# Altium project as14120_x31.PrjPCB (part 2 of 3)

## Sheet as14120_x31_fpga_ddr.SchDoc
size A2; PageSetup: Record=PageOptions|CenterHorizontal=True|CenterVertical=True|PrintScale=1.02|XCorrection=1.00|YCorrection=1.00|PrintKind=1|BorderSize=5000000|LeftOffset=0|BottomOffset=0|Orientation=2|PaperLength=4200|PaperWidth=2970|Scale=100|PaperSource=7|PrintQuality=-4|MediaType=1|DitherType=10|PaperKind=A3 (бумага продольной резки) (297 x 420 мм)|PrintScaleMode=1
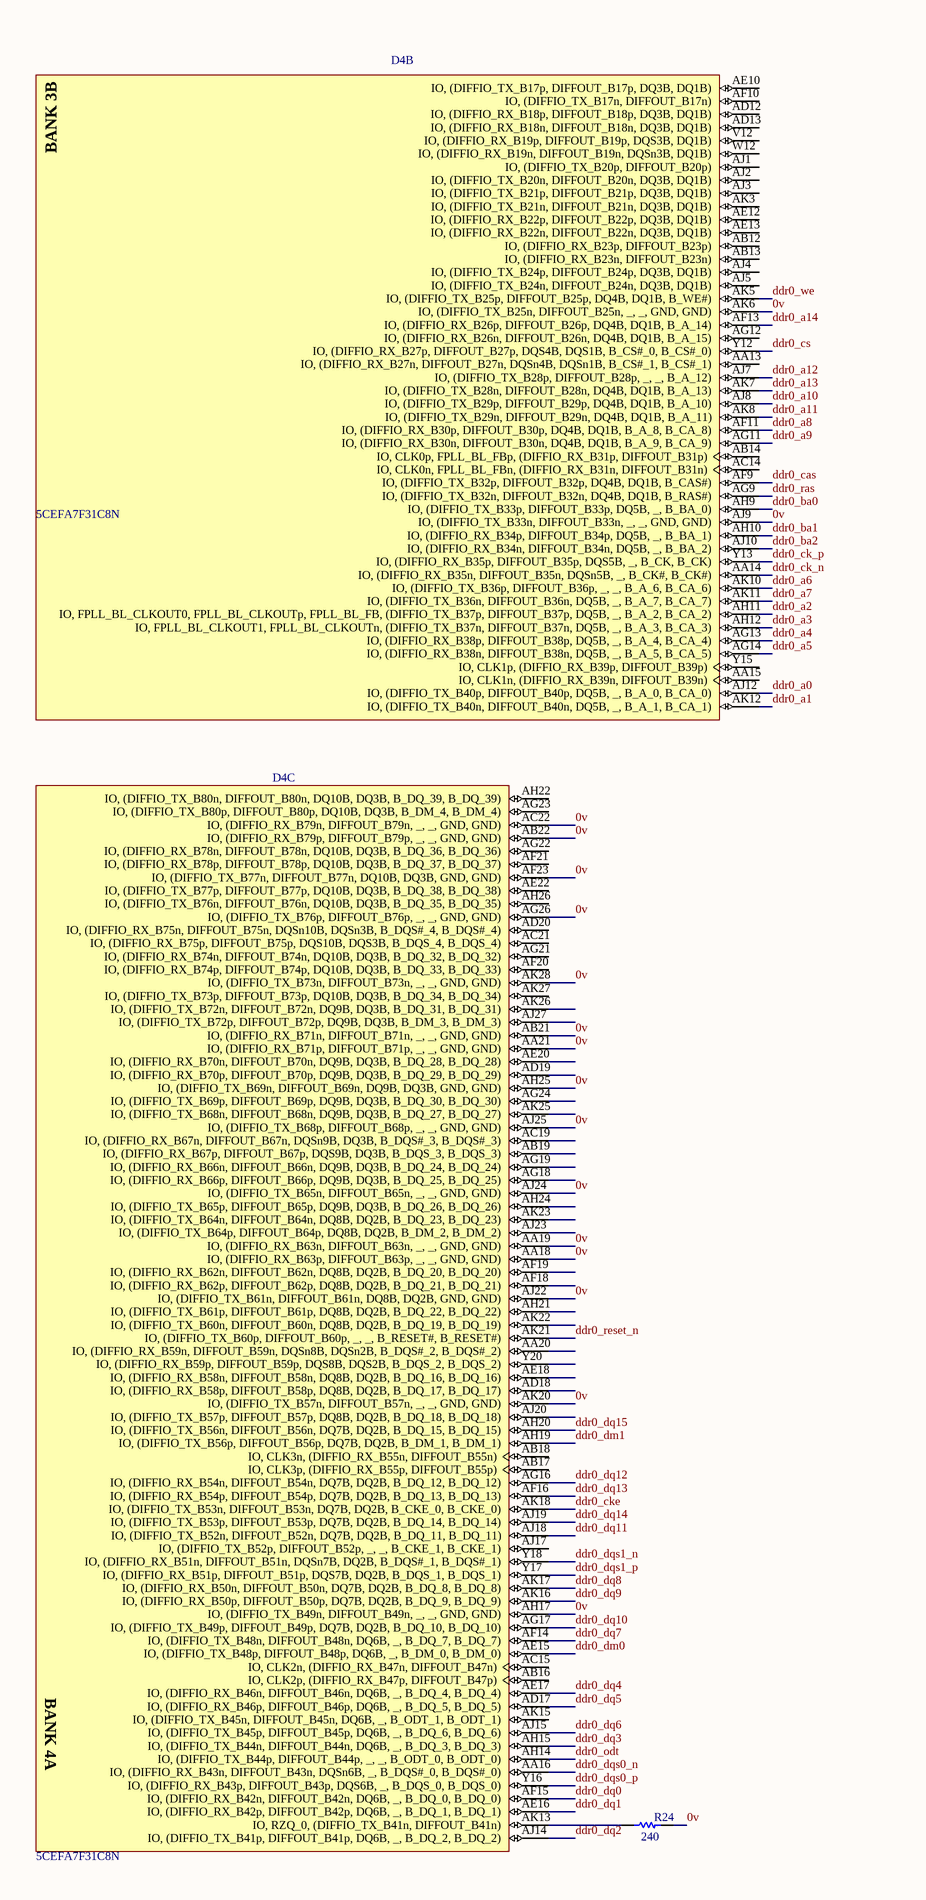
[diagram p4: as14120_x31_fpga_ddr.SchDoc, left]
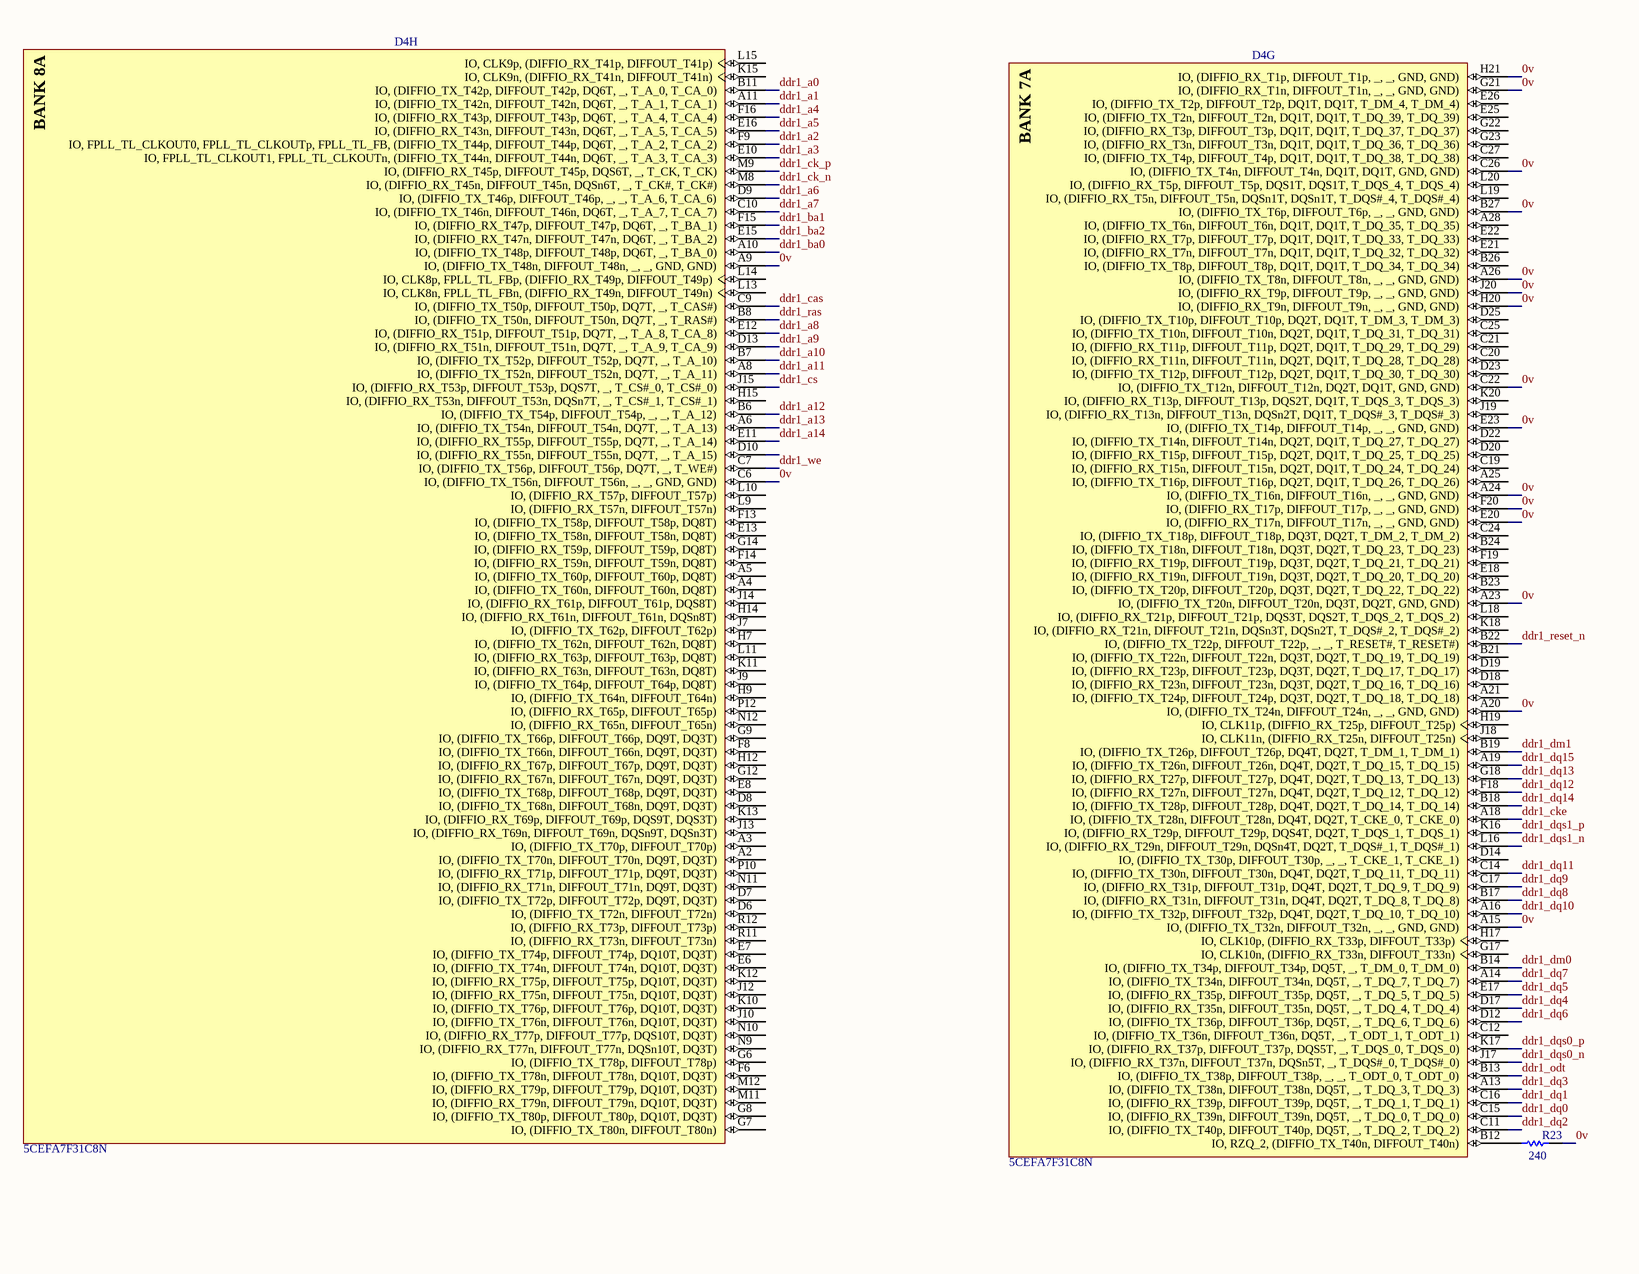
[diagram p5: as14120_x31_fpga_ddr.SchDoc, right]

### Parts
D4  5CEFA7F31C8N  [ALTR-896-FBGA-2000A]  (parts B,C,G,H of 13)
R23  value 240  [RESC0805(2012)_L]  (hidden comment: 1K 1% 0805(2012))
R24  value 240  [RESC0805(2012)_L]  (hidden comment: 1K 1% 0805(2012))

### Nets
0v: D4.A9(IO,_(DIFFIO_TX_T48n,_DIFFOUT_T48n,__,__,_GND,_GND)) D4.A15(IO,_(DIFFIO_TX_T32n,_DIFFOUT_T32n,__,__,_GND,_GND)) D4.A20(IO,_(DIFFIO_TX_T24n,_DIFFOUT_T24n,__,__,_GND,_GND)) D4.A23(IO,_(DIFFIO_TX_T20n,_DIFFOUT_T20n,_DQ3T,_DQ2T,_GND,_GND)) D4.A24(IO,_(DIFFIO_TX_T16n,_DIFFOUT_T16n,__,__,_GND,_GND)) D4.A26(IO,_(DIFFIO_TX_T8n,_DIFFOUT_T8n,__,__,_GND,_GND)) D4.AA18(IO,_(DIFFIO_RX_B63p,_DIFFOUT_B63p,__,__,_GND,_GND)) D4.AA19(IO,_(DIFFIO_RX_B63n,_DIFFOUT_B63n,__,__,_GND,_GND)) D4.AA21(IO,_(DIFFIO_RX_B71p,_DIFFOUT_B71p,__,__,_GND,_GND)) D4.AB21(IO,_(DIFFIO_RX_B71n,_DIFFOUT_B71n,__,__,_GND,_GND)) D4.AB22(IO,_(DIFFIO_RX_B79p,_DIFFOUT_B79p,__,__,_GND,_GND)) D4.AC22(IO,_(DIFFIO_RX_B79n,_DIFFOUT_B79n,__,__,_GND,_GND)) D4.AF23(IO,_(DIFFIO_TX_B77n,_DIFFOUT_B77n,_DQ10B,_DQ3B,_GND,_GND)) D4.AG26(IO,_(DIFFIO_TX_B76p,_DIFFOUT_B76p,__,__,_GND,_GND)) D4.AH17(IO,_(DIFFIO_TX_B49n,_DIFFOUT_B49n,__,__,_GND,_GND)) D4.AH25(IO,_(DIFFIO_TX_B69n,_DIFFOUT_B69n,_DQ9B,_DQ3B,_GND,_GND)) D4.AJ9(IO,_(DIFFIO_TX_B33n,_DIFFOUT_B33n,__,__,_GND,_GND)) D4.AJ22(IO,_(DIFFIO_TX_B61n,_DIFFOUT_B61n,_DQ8B,_DQ2B,_GND,_GND)) D4.AJ24(IO,_(DIFFIO_TX_B65n,_DIFFOUT_B65n,__,__,_GND,_GND)) D4.AJ25(IO,_(DIFFIO_TX_B68p,_DIFFOUT_B68p,__,__,_GND,_GND)) D4.AK6(IO,_(DIFFIO_TX_B25n,_DIFFOUT_B25n,__,__,_GND,_GND)) D4.AK20(IO,_(DIFFIO_TX_B57n,_DIFFOUT_B57n,__,__,_GND,_GND)) D4.AK28(IO,_(DIFFIO_TX_B73n,_DIFFOUT_B73n,__,__,_GND,_GND)) D4.B27(IO,_(DIFFIO_TX_T6p,_DIFFOUT_T6p,__,__,_GND,_GND)) D4.C6(IO,_(DIFFIO_TX_T56n,_DIFFOUT_T56n,__,__,_GND,_GND)) D4.C22(IO,_(DIFFIO_TX_T12n,_DIFFOUT_T12n,_DQ2T,_DQ1T,_GND,_GND)) D4.C26(IO,_(DIFFIO_TX_T4n,_DIFFOUT_T4n,_DQ1T,_DQ1T,_GND,_GND)) D4.E20(IO,_(DIFFIO_RX_T17n,_DIFFOUT_T17n,__,__,_GND,_GND)) D4.E23(IO,_(DIFFIO_TX_T14p,_DIFFOUT_T14p,__,__,_GND,_GND)) D4.F20(IO,_(DIFFIO_RX_T17p,_DIFFOUT_T17p,__,__,_GND,_GND)) D4.G21(IO,_(DIFFIO_RX_T1n,_DIFFOUT_T1n,__,__,_GND,_GND)) D4.H20(IO,_(DIFFIO_RX_T9n,_DIFFOUT_T9n,__,__,_GND,_GND)) D4.H21(IO,_(DIFFIO_RX_T1p,_DIFFOUT_T1p,__,__,_GND,_GND)) D4.J20(IO,_(DIFFIO_RX_T9p,_DIFFOUT_T9p,__,__,_GND,_GND)) R23.2 R24.2
ddr0_a0: D4.AJ12(IO,_(DIFFIO_TX_B40p,_DIFFOUT_B40p,_DQ5B,__,_B_A_0,_B_CA_0))
ddr0_a1: D4.AK12(IO,_(DIFFIO_TX_B40n,_DIFFOUT_B40n,_DQ5B,__,_B_A_1,_B_CA_1))
ddr0_a2: D4.AH11(IO,_FPLL_BL_CLKOUT0,_FPLL_BL_CLKOUTp,_FPLL_BL_FB,_(DIFFIO_TX_B37p,_DIFFOUT_B37p,_DQ5B,__,_B_A_2,_B_CA_2))
ddr0_a3: D4.AH12(IO,_FPLL_BL_CLKOUT1,_FPLL_BL_CLKOUTn,_(DIFFIO_TX_B37n,_DIFFOUT_B37n,_DQ5B,__,_B_A_3,_B_CA_3))
ddr0_a4: D4.AG13(IO,_(DIFFIO_RX_B38p,_DIFFOUT_B38p,_DQ5B,__,_B_A_4,_B_CA_4))
ddr0_a5: D4.AG14(IO,_(DIFFIO_RX_B38n,_DIFFOUT_B38n,_DQ5B,__,_B_A_5,_B_CA_5))
ddr0_a6: D4.AK10(IO,_(DIFFIO_TX_B36p,_DIFFOUT_B36p,__,__,_B_A_6,_B_CA_6))
ddr0_a7: D4.AK11(IO,_(DIFFIO_TX_B36n,_DIFFOUT_B36n,_DQ5B,__,_B_A_7,_B_CA_7))
ddr0_a8: D4.AF11(IO,_(DIFFIO_RX_B30p,_DIFFOUT_B30p,_DQ4B,_DQ1B,_B_A_8,_B_CA_8))
ddr0_a9: D4.AG11(IO,_(DIFFIO_RX_B30n,_DIFFOUT_B30n,_DQ4B,_DQ1B,_B_A_9,_B_CA_9))
ddr0_a10: D4.AJ8(IO,_(DIFFIO_TX_B29p,_DIFFOUT_B29p,_DQ4B,_DQ1B,_B_A_10))
ddr0_a11: D4.AK8(IO,_(DIFFIO_TX_B29n,_DIFFOUT_B29n,_DQ4B,_DQ1B,_B_A_11))
ddr0_a12: D4.AJ7(IO,_(DIFFIO_TX_B28p,_DIFFOUT_B28p,__,__,_B_A_12))
ddr0_a13: D4.AK7(IO,_(DIFFIO_TX_B28n,_DIFFOUT_B28n,_DQ4B,_DQ1B,_B_A_13))
ddr0_a14: D4.AF13(IO,_(DIFFIO_RX_B26p,_DIFFOUT_B26p,_DQ4B,_DQ1B,_B_A_14))
ddr0_ba0: D4.AH9(IO,_(DIFFIO_TX_B33p,_DIFFOUT_B33p,_DQ5B,__,_B_BA_0))
ddr0_ba1: D4.AH10(IO,_(DIFFIO_RX_B34p,_DIFFOUT_B34p,_DQ5B,__,_B_BA_1))
ddr0_ba2: D4.AJ10(IO,_(DIFFIO_RX_B34n,_DIFFOUT_B34n,_DQ5B,__,_B_BA_2))
ddr0_cas: D4.AF9(IO,_(DIFFIO_TX_B32p,_DIFFOUT_B32p,_DQ4B,_DQ1B,_B_CAS#))
ddr0_ck_n: D4.AA14(IO,_(DIFFIO_RX_B35n,_DIFFOUT_B35n,_DQSn5B,__,_B_CK#,_B_CK#))
ddr0_ck_p: D4.Y13(IO,_(DIFFIO_RX_B35p,_DIFFOUT_B35p,_DQS5B,__,_B_CK,_B_CK))
ddr0_cke: D4.AK18(IO,_(DIFFIO_TX_B53n,_DIFFOUT_B53n,_DQ7B,_DQ2B,_B_CKE_0,_B_CKE_0))
ddr0_cs: D4.Y12(IO,_(DIFFIO_RX_B27p,_DIFFOUT_B27p,_DQS4B,_DQS1B,_B_CS#_0,_B_CS#_0))
ddr0_dm0: D4.AE15(IO,_(DIFFIO_TX_B48p,_DIFFOUT_B48p,_DQ6B,__,_B_DM_0,_B_DM_0))
ddr0_dm1: D4.AH19(IO,_(DIFFIO_TX_B56p,_DIFFOUT_B56p,_DQ7B,_DQ2B,_B_DM_1,_B_DM_1))
ddr0_dq0: D4.AF15(IO,_(DIFFIO_RX_B42n,_DIFFOUT_B42n,_DQ6B,__,_B_DQ_0,_B_DQ_0))
ddr0_dq1: D4.AE16(IO,_(DIFFIO_RX_B42p,_DIFFOUT_B42p,_DQ6B,__,_B_DQ_1,_B_DQ_1))
ddr0_dq2: D4.AJ14(IO,_(DIFFIO_TX_B41p,_DIFFOUT_B41p,_DQ6B,__,_B_DQ_2,_B_DQ_2))
ddr0_dq3: D4.AH15(IO,_(DIFFIO_TX_B44n,_DIFFOUT_B44n,_DQ6B,__,_B_DQ_3,_B_DQ_3))
ddr0_dq4: D4.AE17(IO,_(DIFFIO_RX_B46n,_DIFFOUT_B46n,_DQ6B,__,_B_DQ_4,_B_DQ_4))
ddr0_dq5: D4.AD17(IO,_(DIFFIO_RX_B46p,_DIFFOUT_B46p,_DQ6B,__,_B_DQ_5,_B_DQ_5))
ddr0_dq6: D4.AJ15(IO,_(DIFFIO_TX_B45p,_DIFFOUT_B45p,_DQ6B,__,_B_DQ_6,_B_DQ_6))
ddr0_dq7: D4.AF14(IO,_(DIFFIO_TX_B48n,_DIFFOUT_B48n,_DQ6B,__,_B_DQ_7,_B_DQ_7))
ddr0_dq8: D4.AK17(IO,_(DIFFIO_RX_B50n,_DIFFOUT_B50n,_DQ7B,_DQ2B,_B_DQ_8,_B_DQ_8))
ddr0_dq9: D4.AK16(IO,_(DIFFIO_RX_B50p,_DIFFOUT_B50p,_DQ7B,_DQ2B,_B_DQ_9,_B_DQ_9))
ddr0_dq10: D4.AG17(IO,_(DIFFIO_TX_B49p,_DIFFOUT_B49p,_DQ7B,_DQ2B,_B_DQ_10,_B_DQ_10))
ddr0_dq11: D4.AJ18(IO,_(DIFFIO_TX_B52n,_DIFFOUT_B52n,_DQ7B,_DQ2B,_B_DQ_11,_B_DQ_11))
ddr0_dq12: D4.AG16(IO,_(DIFFIO_RX_B54n,_DIFFOUT_B54n,_DQ7B,_DQ2B,_B_DQ_12,_B_DQ_12))
ddr0_dq13: D4.AF16(IO,_(DIFFIO_RX_B54p,_DIFFOUT_B54p,_DQ7B,_DQ2B,_B_DQ_13,_B_DQ_13))
ddr0_dq14: D4.AJ19(IO,_(DIFFIO_TX_B53p,_DIFFOUT_B53p,_DQ7B,_DQ2B,_B_DQ_14,_B_DQ_14))
ddr0_dq15: D4.AH20(IO,_(DIFFIO_TX_B56n,_DIFFOUT_B56n,_DQ7B,_DQ2B,_B_DQ_15,_B_DQ_15))
ddr0_dqs0_n: D4.AA16(IO,_(DIFFIO_RX_B43n,_DIFFOUT_B43n,_DQSn6B,__,_B_DQS#_0,_B_DQS#_0))
ddr0_dqs0_p: D4.Y16(IO,_(DIFFIO_RX_B43p,_DIFFOUT_B43p,_DQS6B,__,_B_DQS_0,_B_DQS_0))
ddr0_dqs1_n: D4.Y18(IO,_(DIFFIO_RX_B51n,_DIFFOUT_B51n,_DQSn7B,_DQ2B,_B_DQS#_1,_B_DQS#_1))
ddr0_dqs1_p: D4.Y17(IO,_(DIFFIO_RX_B51p,_DIFFOUT_B51p,_DQS7B,_DQ2B,_B_DQS_1,_B_DQS_1))
ddr0_odt: D4.AH14(IO,_(DIFFIO_TX_B44p,_DIFFOUT_B44p,__,__,_B_ODT_0,_B_ODT_0))
ddr0_ras: D4.AG9(IO,_(DIFFIO_TX_B32n,_DIFFOUT_B32n,_DQ4B,_DQ1B,_B_RAS#))
ddr0_reset_n: D4.AK21(IO,_(DIFFIO_TX_B60p,_DIFFOUT_B60p,__,__,_B_RESET#,_B_RESET#))
ddr0_we: D4.AK5(IO,_(DIFFIO_TX_B25p,_DIFFOUT_B25p,_DQ4B,_DQ1B,_B_WE#))
ddr1_a0: D4.B11(IO,_(DIFFIO_TX_T42p,_DIFFOUT_T42p,_DQ6T,__,_T_A_0,_T_CA_0))
ddr1_a1: D4.A11(IO,_(DIFFIO_TX_T42n,_DIFFOUT_T42n,_DQ6T,__,_T_A_1,_T_CA_1))
ddr1_a2: D4.F9(IO,_FPLL_TL_CLKOUT0,_FPLL_TL_CLKOUTp,_FPLL_TL_FB,_(DIFFIO_TX_T44p,_DIFFOUT_T44p,_DQ6T,__,_T_A_2,_T_CA_2))
ddr1_a3: D4.E10(IO,_FPLL_TL_CLKOUT1,_FPLL_TL_CLKOUTn,_(DIFFIO_TX_T44n,_DIFFOUT_T44n,_DQ6T,__,_T_A_3,_T_CA_3))
ddr1_a4: D4.F16(IO,_(DIFFIO_RX_T43p,_DIFFOUT_T43p,_DQ6T,__,_T_A_4,_T_CA_4))
ddr1_a5: D4.E16(IO,_(DIFFIO_RX_T43n,_DIFFOUT_T43n,_DQ6T,__,_T_A_5,_T_CA_5))
ddr1_a6: D4.D9(IO,_(DIFFIO_TX_T46p,_DIFFOUT_T46p,__,__,_T_A_6,_T_CA_6))
ddr1_a7: D4.C10(IO,_(DIFFIO_TX_T46n,_DIFFOUT_T46n,_DQ6T,__,_T_A_7,_T_CA_7))
ddr1_a8: D4.E12(IO,_(DIFFIO_RX_T51p,_DIFFOUT_T51p,_DQ7T,__,_T_A_8,_T_CA_8))
ddr1_a9: D4.D13(IO,_(DIFFIO_RX_T51n,_DIFFOUT_T51n,_DQ7T,__,_T_A_9,_T_CA_9))
ddr1_a10: D4.B7(IO,_(DIFFIO_TX_T52p,_DIFFOUT_T52p,_DQ7T,__,_T_A_10))
ddr1_a11: D4.A8(IO,_(DIFFIO_TX_T52n,_DIFFOUT_T52n,_DQ7T,__,_T_A_11))
ddr1_a12: D4.B6(IO,_(DIFFIO_TX_T54p,_DIFFOUT_T54p,__,__,_T_A_12))
ddr1_a13: D4.A6(IO,_(DIFFIO_TX_T54n,_DIFFOUT_T54n,_DQ7T,__,_T_A_13))
ddr1_a14: D4.E11(IO,_(DIFFIO_RX_T55p,_DIFFOUT_T55p,_DQ7T,__,_T_A_14))
ddr1_ba0: D4.A10(IO,_(DIFFIO_TX_T48p,_DIFFOUT_T48p,_DQ6T,__,_T_BA_0))
ddr1_ba1: D4.F15(IO,_(DIFFIO_RX_T47p,_DIFFOUT_T47p,_DQ6T,__,_T_BA_1))
ddr1_ba2: D4.E15(IO,_(DIFFIO_RX_T47n,_DIFFOUT_T47n,_DQ6T,__,_T_BA_2))
ddr1_cas: D4.C9(IO,_(DIFFIO_TX_T50p,_DIFFOUT_T50p,_DQ7T,__,_T_CAS#))
ddr1_ck_n: D4.M8(IO,_(DIFFIO_RX_T45n,_DIFFOUT_T45n,_DQSn6T,__,_T_CK#,_T_CK#))
ddr1_ck_p: D4.M9(IO,_(DIFFIO_RX_T45p,_DIFFOUT_T45p,_DQS6T,__,_T_CK,_T_CK))
ddr1_cke: D4.A18(IO,_(DIFFIO_TX_T28n,_DIFFOUT_T28n,_DQ4T,_DQ2T,_T_CKE_0,_T_CKE_0))
ddr1_cs: D4.J15(IO,_(DIFFIO_RX_T53p,_DIFFOUT_T53p,_DQS7T,__,_T_CS#_0,_T_CS#_0))
ddr1_dm0: D4.B14(IO,_(DIFFIO_TX_T34p,_DIFFOUT_T34p,_DQ5T,__,_T_DM_0,_T_DM_0))
ddr1_dm1: D4.B19(IO,_(DIFFIO_TX_T26p,_DIFFOUT_T26p,_DQ4T,_DQ2T,_T_DM_1,_T_DM_1))
ddr1_dq0: D4.C15(IO,_(DIFFIO_RX_T39n,_DIFFOUT_T39n,_DQ5T,__,_T_DQ_0,_T_DQ_0))
ddr1_dq1: D4.C16(IO,_(DIFFIO_RX_T39p,_DIFFOUT_T39p,_DQ5T,__,_T_DQ_1,_T_DQ_1))
ddr1_dq2: D4.C11(IO,_(DIFFIO_TX_T40p,_DIFFOUT_T40p,_DQ5T,__,_T_DQ_2,_T_DQ_2))
ddr1_dq3: D4.A13(IO,_(DIFFIO_TX_T38n,_DIFFOUT_T38n,_DQ5T,__,_T_DQ_3,_T_DQ_3))
ddr1_dq4: D4.D17(IO,_(DIFFIO_RX_T35n,_DIFFOUT_T35n,_DQ5T,__,_T_DQ_4,_T_DQ_4))
ddr1_dq5: D4.E17(IO,_(DIFFIO_RX_T35p,_DIFFOUT_T35p,_DQ5T,__,_T_DQ_5,_T_DQ_5))
ddr1_dq6: D4.D12(IO,_(DIFFIO_TX_T36p,_DIFFOUT_T36p,_DQ5T,__,_T_DQ_6,_T_DQ_6))
ddr1_dq7: D4.A14(IO,_(DIFFIO_TX_T34n,_DIFFOUT_T34n,_DQ5T,__,_T_DQ_7,_T_DQ_7))
ddr1_dq8: D4.B17(IO,_(DIFFIO_RX_T31n,_DIFFOUT_T31n,_DQ4T,_DQ2T,_T_DQ_8,_T_DQ_8))
ddr1_dq9: D4.C17(IO,_(DIFFIO_RX_T31p,_DIFFOUT_T31p,_DQ4T,_DQ2T,_T_DQ_9,_T_DQ_9))
ddr1_dq10: D4.A16(IO,_(DIFFIO_TX_T32p,_DIFFOUT_T32p,_DQ4T,_DQ2T,_T_DQ_10,_T_DQ_10))
ddr1_dq11: D4.C14(IO,_(DIFFIO_TX_T30n,_DIFFOUT_T30n,_DQ4T,_DQ2T,_T_DQ_11,_T_DQ_11))
ddr1_dq12: D4.F18(IO,_(DIFFIO_RX_T27n,_DIFFOUT_T27n,_DQ4T,_DQ2T,_T_DQ_12,_T_DQ_12))
ddr1_dq13: D4.G18(IO,_(DIFFIO_RX_T27p,_DIFFOUT_T27p,_DQ4T,_DQ2T,_T_DQ_13,_T_DQ_13))
ddr1_dq14: D4.B18(IO,_(DIFFIO_TX_T28p,_DIFFOUT_T28p,_DQ4T,_DQ2T,_T_DQ_14,_T_DQ_14))
ddr1_dq15: D4.A19(IO,_(DIFFIO_TX_T26n,_DIFFOUT_T26n,_DQ4T,_DQ2T,_T_DQ_15,_T_DQ_15))
ddr1_dqs0_n: D4.J17(IO,_(DIFFIO_RX_T37n,_DIFFOUT_T37n,_DQSn5T,__,_T_DQS#_0,_T_DQS#_0))
ddr1_dqs0_p: D4.K17(IO,_(DIFFIO_RX_T37p,_DIFFOUT_T37p,_DQS5T,__,_T_DQS_0,_T_DQS_0))
ddr1_dqs1_n: D4.L16(IO,_(DIFFIO_RX_T29n,_DIFFOUT_T29n,_DQSn4T,_DQ2T,_T_DQS#_1,_T_DQS#_1))
ddr1_dqs1_p: D4.K16(IO,_(DIFFIO_RX_T29p,_DIFFOUT_T29p,_DQS4T,_DQ2T,_T_DQS_1,_T_DQS_1))
ddr1_odt: D4.B13(IO,_(DIFFIO_TX_T38p,_DIFFOUT_T38p,__,__,_T_ODT_0,_T_ODT_0))
ddr1_ras: D4.B8(IO,_(DIFFIO_TX_T50n,_DIFFOUT_T50n,_DQ7T,__,_T_RAS#))
ddr1_reset_n: D4.B22(IO,_(DIFFIO_TX_T22p,_DIFFOUT_T22p,__,__,_T_RESET#,_T_RESET#))
ddr1_we: D4.C7(IO,_(DIFFIO_TX_T56p,_DIFFOUT_T56p,_DQ7T,__,_T_WE#))
NetD4_AK13: D4.AK13(IO,_RZQ_0,_(DIFFIO_TX_B41n,_DIFFOUT_B41n)) R24.1
NetD4_B12: D4.B12(IO,_RZQ_2,_(DIFFIO_TX_T40n,_DIFFOUT_T40n)) R23.1

Not connected (* = marked no-connect by the designer): D4 A2(IO,_(DIFFIO_TX_T70n,_DIFFOUT_T70n,_DQ9T,_DQ3T)) A3(IO,_(DIFFIO_TX_T70p,_DIFFOUT_T70p)) A4(IO,_(DIFFIO_TX_T60n,_DIFFOUT_T60n,_DQ8T)) A5(IO,_(DIFFIO_TX_T60p,_DIFFOUT_T60p,_DQ8T)) A21(IO,_(DIFFIO_TX_T24p,_DIFFOUT_T24p,_DQ3T,_DQ2T,_T_DQ_18,_T_DQ_18)) A25(IO,_(DIFFIO_TX_T16p,_DIFFOUT_T16p,_DQ2T,_DQ1T,_T_DQ_26,_T_DQ_26)) A28(IO,_(DIFFIO_TX_T6n,_DIFFOUT_T6n,_DQ1T,_DQ1T,_T_DQ_35,_T_DQ_35)) AA13(IO,_(DIFFIO_RX_B27n,_DIFFOUT_B27n,_DQSn4B,_DQSn1B,_B_CS#_1,_B_CS#_1)) AA15(IO,_CLK1n,_(DIFFIO_RX_B39n,_DIFFOUT_B39n)) AA20(IO,_(DIFFIO_RX_B59n,_DIFFOUT_B59n,_DQSn8B,_DQSn2B,_B_DQS#_2,_B_DQS#_2)) AB12(IO,_(DIFFIO_RX_B23p,_DIFFOUT_B23p)) AB13(IO,_(DIFFIO_RX_B23n,_DIFFOUT_B23n)) AB14(IO,_CLK0p,_FPLL_BL_FBp,_(DIFFIO_RX_B31p,_DIFFOUT_B31p)) AB16(IO,_CLK2p,_(DIFFIO_RX_B47p,_DIFFOUT_B47p)) AB17(IO,_CLK3p,_(DIFFIO_RX_B55p,_DIFFOUT_B55p)) AB18(IO,_CLK3n,_(DIFFIO_RX_B55n,_DIFFOUT_B55n)) AB19(IO,_(DIFFIO_RX_B67p,_DIFFOUT_B67p,_DQS9B,_DQ3B,_B_DQS_3,_B_DQS_3)) AC14(IO,_CLK0n,_FPLL_BL_FBn,_(DIFFIO_RX_B31n,_DIFFOUT_B31n)) AC15(IO,_CLK2n,_(DIFFIO_RX_B47n,_DIFFOUT_B47n)) AC19(IO,_(DIFFIO_RX_B67n,_DIFFOUT_B67n,_DQSn9B,_DQ3B,_B_DQS#_3,_B_DQS#_3)) AC21(IO,_(DIFFIO_RX_B75p,_DIFFOUT_B75p,_DQS10B,_DQS3B,_B_DQS_4,_B_DQS_4)) AD12(IO,_(DIFFIO_RX_B18p,_DIFFOUT_B18p,_DQ3B,_DQ1B)) AD13(IO,_(DIFFIO_RX_B18n,_DIFFOUT_B18n,_DQ3B,_DQ1B)) AD18(IO,_(DIFFIO_RX_B58p,_DIFFOUT_B58p,_DQ8B,_DQ2B,_B_DQ_17,_B_DQ_17)) AD19(IO,_(DIFFIO_RX_B70p,_DIFFOUT_B70p,_DQ9B,_DQ3B,_B_DQ_29,_B_DQ_29)) AD20(IO,_(DIFFIO_RX_B75n,_DIFFOUT_B75n,_DQSn10B,_DQSn3B,_B_DQS#_4,_B_DQS#_4)) AE10(IO,_(DIFFIO_TX_B17p,_DIFFOUT_B17p,_DQ3B,_DQ1B)) AE12(IO,_(DIFFIO_RX_B22p,_DIFFOUT_B22p,_DQ3B,_DQ1B)) AE13(IO,_(DIFFIO_RX_B22n,_DIFFOUT_B22n,_DQ3B,_DQ1B)) AE18(IO,_(DIFFIO_RX_B58n,_DIFFOUT_B58n,_DQ8B,_DQ2B,_B_DQ_16,_B_DQ_16)) AE20(IO,_(DIFFIO_RX_B70n,_DIFFOUT_B70n,_DQ9B,_DQ3B,_B_DQ_28,_B_DQ_28)) AE22(IO,_(DIFFIO_TX_B77p,_DIFFOUT_B77p,_DQ10B,_DQ3B,_B_DQ_38,_B_DQ_38)) AF10(IO,_(DIFFIO_TX_B17n,_DIFFOUT_B17n)) AF18(IO,_(DIFFIO_RX_B62p,_DIFFOUT_B62p,_DQ8B,_DQ2B,_B_DQ_21,_B_DQ_21)) AF19(IO,_(DIFFIO_RX_B62n,_DIFFOUT_B62n,_DQ8B,_DQ2B,_B_DQ_20,_B_DQ_20)) AF20(IO,_(DIFFIO_RX_B74p,_DIFFOUT_B74p,_DQ10B,_DQ3B,_B_DQ_33,_B_DQ_33)) AF21(IO,_(DIFFIO_RX_B78p,_DIFFOUT_B78p,_DQ10B,_DQ3B,_B_DQ_37,_B_DQ_37)) AG12(IO,_(DIFFIO_RX_B26n,_DIFFOUT_B26n,_DQ4B,_DQ1B,_B_A_15)) AG18(IO,_(DIFFIO_RX_B66p,_DIFFOUT_B66p,_DQ9B,_DQ3B,_B_DQ_25,_B_DQ_25)) AG19(IO,_(DIFFIO_RX_B66n,_DIFFOUT_B66n,_DQ9B,_DQ3B,_B_DQ_24,_B_DQ_24)) AG21(IO,_(DIFFIO_RX_B74n,_DIFFOUT_B74n,_DQ10B,_DQ3B,_B_DQ_32,_B_DQ_32)) AG22(IO,_(DIFFIO_RX_B78n,_DIFFOUT_B78n,_DQ10B,_DQ3B,_B_DQ_36,_B_DQ_36)) AG23(IO,_(DIFFIO_TX_B80p,_DIFFOUT_B80p,_DQ10B,_DQ3B,_B_DM_4,_B_DM_4)) AG24(IO,_(DIFFIO_TX_B69p,_DIFFOUT_B69p,_DQ9B,_DQ3B,_B_DQ_30,_B_DQ_30)) AH21(IO,_(DIFFIO_TX_B61p,_DIFFOUT_B61p,_DQ8B,_DQ2B,_B_DQ_22,_B_DQ_22)) AH22(IO,_(DIFFIO_TX_B80n,_DIFFOUT_B80n,_DQ10B,_DQ3B,_B_DQ_39,_B_DQ_39)) AH24(IO,_(DIFFIO_TX_B65p,_DIFFOUT_B65p,_DQ9B,_DQ3B,_B_DQ_26,_B_DQ_26)) AH26(IO,_(DIFFIO_TX_B76n,_DIFFOUT_B76n,_DQ10B,_DQ3B,_B_DQ_35,_B_DQ_35)) AJ1(IO,_(DIFFIO_TX_B20p,_DIFFOUT_B20p)) AJ2(IO,_(DIFFIO_TX_B20n,_DIFFOUT_B20n,_DQ3B,_DQ1B)) AJ3(IO,_(DIFFIO_TX_B21p,_DIFFOUT_B21p,_DQ3B,_DQ1B)) AJ4(IO,_(DIFFIO_TX_B24p,_DIFFOUT_B24p,_DQ3B,_DQ1B)) AJ5(IO,_(DIFFIO_TX_B24n,_DIFFOUT_B24n,_DQ3B,_DQ1B)) AJ17(IO,_(DIFFIO_TX_B52p,_DIFFOUT_B52p,__,__,_B_CKE_1,_B_CKE_1)) AJ20(IO,_(DIFFIO_TX_B57p,_DIFFOUT_B57p,_DQ8B,_DQ2B,_B_DQ_18,_B_DQ_18)) AJ23(IO,_(DIFFIO_TX_B64p,_DIFFOUT_B64p,_DQ8B,_DQ2B,_B_DM_2,_B_DM_2)) AJ27(IO,_(DIFFIO_TX_B72p,_DIFFOUT_B72p,_DQ9B,_DQ3B,_B_DM_3,_B_DM_3)) AK3(IO,_(DIFFIO_TX_B21n,_DIFFOUT_B21n,_DQ3B,_DQ1B)) AK15(IO,_(DIFFIO_TX_B45n,_DIFFOUT_B45n,_DQ6B,__,_B_ODT_1,_B_ODT_1)) AK22(IO,_(DIFFIO_TX_B60n,_DIFFOUT_B60n,_DQ8B,_DQ2B,_B_DQ_19,_B_DQ_19)) AK23(IO,_(DIFFIO_TX_B64n,_DIFFOUT_B64n,_DQ8B,_DQ2B,_B_DQ_23,_B_DQ_23)) AK25(IO,_(DIFFIO_TX_B68n,_DIFFOUT_B68n,_DQ9B,_DQ3B,_B_DQ_27,_B_DQ_27)) AK26(IO,_(DIFFIO_TX_B72n,_DIFFOUT_B72n,_DQ9B,_DQ3B,_B_DQ_31,_B_DQ_31)) AK27(IO,_(DIFFIO_TX_B73p,_DIFFOUT_B73p,_DQ10B,_DQ3B,_B_DQ_34,_B_DQ_34)) B21(IO,_(DIFFIO_TX_T22n,_DIFFOUT_T22n,_DQ3T,_DQ2T,_T_DQ_19,_T_DQ_19)) B23(IO,_(DIFFIO_TX_T20p,_DIFFOUT_T20p,_DQ3T,_DQ2T,_T_DQ_22,_T_DQ_22)) B24(IO,_(DIFFIO_TX_T18n,_DIFFOUT_T18n,_DQ3T,_DQ2T,_T_DQ_23,_T_DQ_23)) B26(IO,_(DIFFIO_TX_T8p,_DIFFOUT_T8p,_DQ1T,_DQ1T,_T_DQ_34,_T_DQ_34)) C12(IO,_(DIFFIO_TX_T36n,_DIFFOUT_T36n,_DQ5T,__,_T_ODT_1,_T_ODT_1)) C19(IO,_(DIFFIO_RX_T15n,_DIFFOUT_T15n,_DQ2T,_DQ1T,_T_DQ_24,_T_DQ_24)) C20(IO,_(DIFFIO_RX_T11n,_DIFFOUT_T11n,_DQ2T,_DQ1T,_T_DQ_28,_T_DQ_28)) C21(IO,_(DIFFIO_RX_T11p,_DIFFOUT_T11p,_DQ2T,_DQ1T,_T_DQ_29,_T_DQ_29)) C24(IO,_(DIFFIO_TX_T18p,_DIFFOUT_T18p,_DQ3T,_DQ2T,_T_DM_2,_T_DM_2)) C25(IO,_(DIFFIO_TX_T10n,_DIFFOUT_T10n,_DQ2T,_DQ1T,_T_DQ_31,_T_DQ_31)) C27(IO,_(DIFFIO_TX_T4p,_DIFFOUT_T4p,_DQ1T,_DQ1T,_T_DQ_38,_T_DQ_38)) D6(IO,_(DIFFIO_TX_T72n,_DIFFOUT_T72n)) D7(IO,_(DIFFIO_TX_T72p,_DIFFOUT_T72p,_DQ9T,_DQ3T)) D8(IO,_(DIFFIO_TX_T68n,_DIFFOUT_T68n,_DQ9T,_DQ3T)) D10(IO,_(DIFFIO_RX_T55n,_DIFFOUT_T55n,_DQ7T,__,_T_A_15)) D14(IO,_(DIFFIO_TX_T30p,_DIFFOUT_T30p,__,__,_T_CKE_1,_T_CKE_1)) D18(IO,_(DIFFIO_RX_T23n,_DIFFOUT_T23n,_DQ3T,_DQ2T,_T_DQ_16,_T_DQ_16)) D19(IO,_(DIFFIO_RX_T23p,_DIFFOUT_T23p,_DQ3T,_DQ2T,_T_DQ_17,_T_DQ_17)) D20(IO,_(DIFFIO_RX_T15p,_DIFFOUT_T15p,_DQ2T,_DQ1T,_T_DQ_25,_T_DQ_25)) D22(IO,_(DIFFIO_TX_T14n,_DIFFOUT_T14n,_DQ2T,_DQ1T,_T_DQ_27,_T_DQ_27)) D23(IO,_(DIFFIO_TX_T12p,_DIFFOUT_T12p,_DQ2T,_DQ1T,_T_DQ_30,_T_DQ_30)) D25(IO,_(DIFFIO_TX_T10p,_DIFFOUT_T10p,_DQ2T,_DQ1T,_T_DM_3,_T_DM_3)) E6(IO,_(DIFFIO_TX_T74n,_DIFFOUT_T74n,_DQ10T,_DQ3T)) E7(IO,_(DIFFIO_TX_T74p,_DIFFOUT_T74p,_DQ10T,_DQ3T)) E8(IO,_(DIFFIO_TX_T68p,_DIFFOUT_T68p,_DQ9T,_DQ3T)) E13(IO,_(DIFFIO_TX_T58n,_DIFFOUT_T58n,_DQ8T)) E18(IO,_(DIFFIO_RX_T19n,_DIFFOUT_T19n,_DQ3T,_DQ2T,_T_DQ_20,_T_DQ_20)) E21(IO,_(DIFFIO_RX_T7n,_DIFFOUT_T7n,_DQ1T,_DQ1T,_T_DQ_32,_T_DQ_32)) E22(IO,_(DIFFIO_RX_T7p,_DIFFOUT_T7p,_DQ1T,_DQ1T,_T_DQ_33,_T_DQ_33)) E25(IO,_(DIFFIO_TX_T2n,_DIFFOUT_T2n,_DQ1T,_DQ1T,_T_DQ_39,_T_DQ_39)) E26(IO,_(DIFFIO_TX_T2p,_DIFFOUT_T2p,_DQ1T,_DQ1T,_T_DM_4,_T_DM_4)) F6(IO,_(DIFFIO_TX_T78n,_DIFFOUT_T78n,_DQ10T,_DQ3T)) F8(IO,_(DIFFIO_TX_T66n,_DIFFOUT_T66n,_DQ9T,_DQ3T)) F13(IO,_(DIFFIO_TX_T58p,_DIFFOUT_T58p,_DQ8T)) F14(IO,_(DIFFIO_RX_T59n,_DIFFOUT_T59n,_DQ8T)) F19(IO,_(DIFFIO_RX_T19p,_DIFFOUT_T19p,_DQ3T,_DQ2T,_T_DQ_21,_T_DQ_21)) G6(IO,_(DIFFIO_TX_T78p,_DIFFOUT_T78p)) G7(IO,_(DIFFIO_TX_T80n,_DIFFOUT_T80n)) G8(IO,_(DIFFIO_TX_T80p,_DIFFOUT_T80p,_DQ10T,_DQ3T)) G9(IO,_(DIFFIO_TX_T66p,_DIFFOUT_T66p,_DQ9T,_DQ3T)) G12(IO,_(DIFFIO_RX_T67n,_DIFFOUT_T67n,_DQ9T,_DQ3T)) G14(IO,_(DIFFIO_RX_T59p,_DIFFOUT_T59p,_DQ8T)) G17(IO,_CLK10n,_(DIFFIO_RX_T33n,_DIFFOUT_T33n)) G22(IO,_(DIFFIO_RX_T3p,_DIFFOUT_T3p,_DQ1T,_DQ1T,_T_DQ_37,_T_DQ_37)) G23(IO,_(DIFFIO_RX_T3n,_DIFFOUT_T3n,_DQ1T,_DQ1T,_T_DQ_36,_T_DQ_36)) H7(IO,_(DIFFIO_TX_T62n,_DIFFOUT_T62n,_DQ8T)) H9(IO,_(DIFFIO_TX_T64n,_DIFFOUT_T64n)) H12(IO,_(DIFFIO_RX_T67p,_DIFFOUT_T67p,_DQ9T,_DQ3T)) H14(IO,_(DIFFIO_RX_T61n,_DIFFOUT_T61n,_DQSn8T)) H15(IO,_(DIFFIO_RX_T53n,_DIFFOUT_T53n,_DQSn7T,__,_T_CS#_1,_T_CS#_1)) H17(IO,_CLK10p,_(DIFFIO_RX_T33p,_DIFFOUT_T33p)) H19(IO,_CLK11p,_(DIFFIO_RX_T25p,_DIFFOUT_T25p)) J7(IO,_(DIFFIO_TX_T62p,_DIFFOUT_T62p)) J9(IO,_(DIFFIO_TX_T64p,_DIFFOUT_T64p,_DQ8T)) J10(IO,_(DIFFIO_TX_T76n,_DIFFOUT_T76n,_DQ10T,_DQ3T)) J12(IO,_(DIFFIO_RX_T75n,_DIFFOUT_T75n,_DQ10T,_DQ3T)) J13(IO,_(DIFFIO_RX_T69n,_DIFFOUT_T69n,_DQSn9T,_DQSn3T)) J14(IO,_(DIFFIO_RX_T61p,_DIFFOUT_T61p,_DQS8T)) J18(IO,_CLK11n,_(DIFFIO_RX_T25n,_DIFFOUT_T25n)) J19(IO,_(DIFFIO_RX_T13n,_DIFFOUT_T13n,_DQSn2T,_DQ1T,_T_DQS#_3,_T_DQS#_3)) K10(IO,_(DIFFIO_TX_T76p,_DIFFOUT_T76p,_DQ10T,_DQ3T)) K11(IO,_(DIFFIO_RX_T63n,_DIFFOUT_T63n,_DQ8T)) K12(IO,_(DIFFIO_RX_T75p,_DIFFOUT_T75p,_DQ10T,_DQ3T)) K13(IO,_(DIFFIO_RX_T69p,_DIFFOUT_T69p,_DQS9T,_DQS3T)) K15(IO,_CLK9n,_(DIFFIO_RX_T41n,_DIFFOUT_T41n)) K18(IO,_(DIFFIO_RX_T21n,_DIFFOUT_T21n,_DQSn3T,_DQSn2T,_T_DQS#_2,_T_DQS#_2)) K20(IO,_(DIFFIO_RX_T13p,_DIFFOUT_T13p,_DQS2T,_DQ1T,_T_DQS_3,_T_DQS_3)) L9(IO,_(DIFFIO_RX_T57n,_DIFFOUT_T57n)) L10(IO,_(DIFFIO_RX_T57p,_DIFFOUT_T57p)) L11(IO,_(DIFFIO_RX_T63p,_DIFFOUT_T63p,_DQ8T)) L13(IO,_CLK8n,_FPLL_TL_FBn,_(DIFFIO_RX_T49n,_DIFFOUT_T49n)) L14(IO,_CLK8p,_FPLL_TL_FBp,_(DIFFIO_RX_T49p,_DIFFOUT_T49p)) L15(IO,_CLK9p,_(DIFFIO_RX_T41p,_DIFFOUT_T41p)) L18(IO,_(DIFFIO_RX_T21p,_DIFFOUT_T21p,_DQS3T,_DQS2T,_T_DQS_2,_T_DQS_2)) L19(IO,_(DIFFIO_RX_T5n,_DIFFOUT_T5n,_DQSn1T,_DQSn1T,_T_DQS#_4,_T_DQS#_4)) L20(IO,_(DIFFIO_RX_T5p,_DIFFOUT_T5p,_DQS1T,_DQS1T,_T_DQS_4,_T_DQS_4)) M11(IO,_(DIFFIO_RX_T79n,_DIFFOUT_T79n,_DQ10T,_DQ3T)) M12(IO,_(DIFFIO_RX_T79p,_DIFFOUT_T79p,_DQ10T,_DQ3T)) N9(IO,_(DIFFIO_RX_T77n,_DIFFOUT_T77n,_DQSn10T,_DQ3T)) N10(IO,_(DIFFIO_RX_T77p,_DIFFOUT_T77p,_DQS10T,_DQ3T)) N11(IO,_(DIFFIO_RX_T71n,_DIFFOUT_T71n,_DQ9T,_DQ3T)) N12(IO,_(DIFFIO_RX_T65n,_DIFFOUT_T65n)) P10(IO,_(DIFFIO_RX_T71p,_DIFFOUT_T71p,_DQ9T,_DQ3T)) P12(IO,_(DIFFIO_RX_T65p,_DIFFOUT_T65p)) R11(IO,_(DIFFIO_RX_T73n,_DIFFOUT_T73n)) R12(IO,_(DIFFIO_RX_T73p,_DIFFOUT_T73p)) V12(IO,_(DIFFIO_RX_B19p,_DIFFOUT_B19p,_DQS3B,_DQ1B)) W12(IO,_(DIFFIO_RX_B19n,_DIFFOUT_B19n,_DQSn3B,_DQ1B)) Y15(IO,_CLK1p,_(DIFFIO_RX_B39p,_DIFFOUT_B39p)) Y20(IO,_(DIFFIO_RX_B59p,_DIFFOUT_B59p,_DQS8B,_DQS2B,_B_DQS_2,_B_DQS_2))

### Notes on the sheet
- Title
- Size:
- Date:
- File:
- A2
- Number:
- Time:
- Revision:
- Sheet
- of
- (in symbol 5CEFA7F31C8N, part B) BANK 3B
- (in symbol 5CEFA7F31C8N, part C) BANK 4A
- (in symbol 5CEFA7F31C8N, part G) BANK 7A
- (in symbol 5CEFA7F31C8N, part H) BANK 8A

### Library data of the parts
D4 = 5CEFA7F31C8N: Cyclone V E Family FPGA, 1.07 to 1.13 V Supply, 480 I/O Pins, 7 PLLs, 896-Pin FBGA, Speed Grade 8, Commercial Grade, RoHS Compliant; Manufacturer: Altera; Device Group: 5CEFA7; GPIO: 480; Logic Elements (LE) (K): 149.5; Speed Grade: 8; DatasheetVersion: Rev. 3.1; PackageReference: 896-FBGA-2000A; PackageDescription: 896-Pin FineLine Ball-Grid Array (FBGA), Body 31 x 31 mm, Pitch 1 mm; Supplier 1: Digi-Key; Supplier Part Number 1: 544-2768-ND; Supplier 2: Mouser; Supplier Part Number 2: 989-5CEFA7F31C8N; RoHS: RoHS Compliant; Subcategory: Cyclone V E; Voltage Supply: 1.07 to 1.13 V; Mounting Technology: Surface Mount; Code_JEDEC: MS-034-AAN-1; PartNumber: 5CEFA7F31C8N; ComponentLink1Description: Manufacturer URL; ComponentLink1URL: http://www.altera.com; ComponentLink2Description: Datasheet; ComponentLink2URL: http://www.altera.com/literature/hb/cyclone-v/cv_51002.pdf; ComponentLink3Description: Package Specification; ComponentLink3URL: http://www.altera.com/devicepackaging/04R00435-01.pdf; ComponentLink4Description: Device Handbook URL; ComponentLink4URL: http://www.altera.com/literature/hb/cyclone-v/cyclone5_handbook.pdf; ComponentLink5Description: Device Overview URL; ComponentLink5URL: http://www.altera.com/literature/hb/cyclone-v/cv_51001.pdf; ComponentLink6Description: Device Pin-Out URL; ComponentLink6URL: http://www.altera.com/literature/dp/cyclone-v/1.1.txt; ComponentLink7Description: Product URL; ComponentLink7URL: http://www.buyaltera.com/scripts/partsearch.dll?Detail&name=5CEFA7F31C8N-ND
R23 R24 = RES_0805: 1K 0.125W 1% 0805 (2012 Metric)  SMD; Case-Metric: 2012; Case-EIA: 0805; Tolerance: 1 %; Power: 0.125 W; Technology: SMT

## Sheet as14120_x31_fpga_cypress.SchDoc
size A3
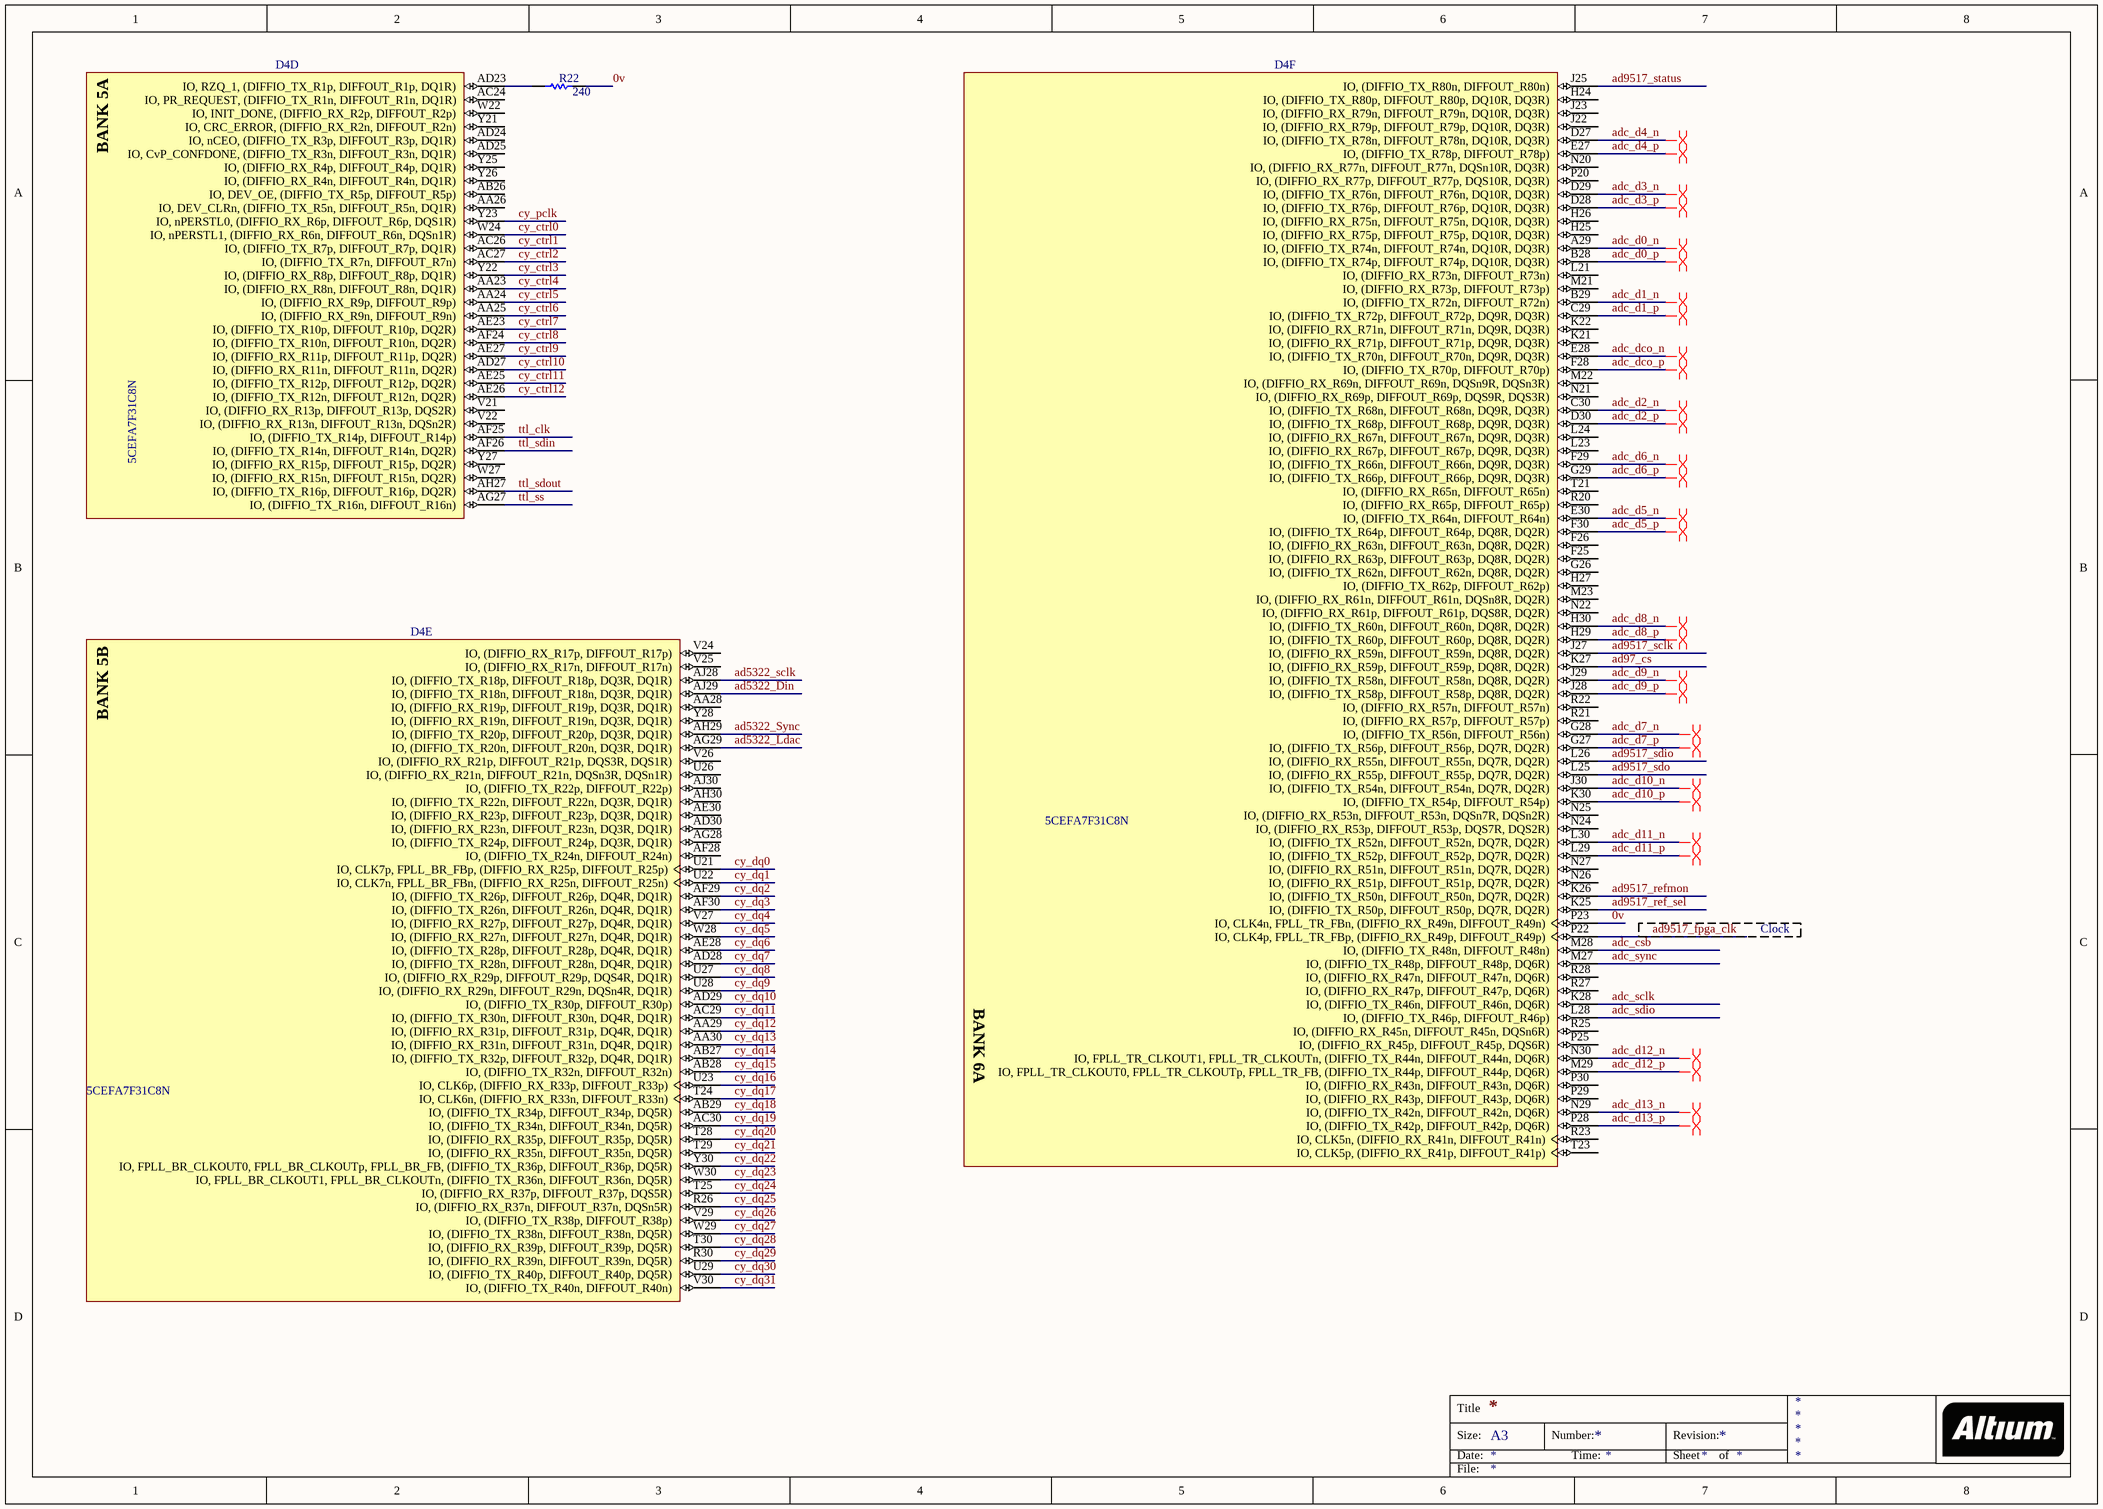
[diagram p6: as14120_x31_fpga_cypress.SchDoc]

### Parts
D4  5CEFA7F31C8N  [ALTR-896-FBGA-2000A]  (parts D,E,F of 13)
R22  240  [RESC0603(1608)_L]

### Nets
0v: D4.P23(IO,_CLK4n,_FPLL_TR_FBn,_(DIFFIO_RX_R49n,_DIFFOUT_R49n)) R22.2
ad97_cs: D4.K27(IO,_(DIFFIO_RX_R59p,_DIFFOUT_R59p,_DQ8R,_DQ2R))
ad5322_Din: D4.AJ29(IO,_(DIFFIO_TX_R18n,_DIFFOUT_R18n,_DQ3R,_DQ1R))
ad5322_Ldac: D4.AG29(IO,_(DIFFIO_TX_R20n,_DIFFOUT_R20n,_DQ3R,_DQ1R))
ad5322_sclk: D4.AJ28(IO,_(DIFFIO_TX_R18p,_DIFFOUT_R18p,_DQ3R,_DQ1R))
ad5322_Sync: D4.AH29(IO,_(DIFFIO_TX_R20p,_DIFFOUT_R20p,_DQ3R,_DQ1R))
ad9517_fpga_clk: D4.P22(IO,_CLK4p,_FPLL_TR_FBp,_(DIFFIO_RX_R49p,_DIFFOUT_R49p))
ad9517_ref_sel: D4.K25(IO,_(DIFFIO_TX_R50p,_DIFFOUT_R50p,_DQ7R,_DQ2R))
ad9517_refmon: D4.K26(IO,_(DIFFIO_TX_R50n,_DIFFOUT_R50n,_DQ7R,_DQ2R))
ad9517_sclk: D4.J27(IO,_(DIFFIO_RX_R59n,_DIFFOUT_R59n,_DQ8R,_DQ2R))
ad9517_sdio: D4.L26(IO,_(DIFFIO_RX_R55n,_DIFFOUT_R55n,_DQ7R,_DQ2R))
ad9517_sdo: D4.L25(IO,_(DIFFIO_RX_R55p,_DIFFOUT_R55p,_DQ7R,_DQ2R))
ad9517_status: D4.J25(IO,_(DIFFIO_TX_R80n,_DIFFOUT_R80n))
adc_csb: D4.M28(IO,_(DIFFIO_TX_R48n,_DIFFOUT_R48n))
adc_d0_n: D4.A29(IO,_(DIFFIO_TX_R74n,_DIFFOUT_R74n,_DQ10R,_DQ3R))
adc_d0_p: D4.B28(IO,_(DIFFIO_TX_R74p,_DIFFOUT_R74p,_DQ10R,_DQ3R))
adc_d1_n: D4.B29(IO,_(DIFFIO_TX_R72n,_DIFFOUT_R72n))
adc_d1_p: D4.C29(IO,_(DIFFIO_TX_R72p,_DIFFOUT_R72p,_DQ9R,_DQ3R))
adc_d2_n: D4.C30(IO,_(DIFFIO_TX_R68n,_DIFFOUT_R68n,_DQ9R,_DQ3R))
adc_d2_p: D4.D30(IO,_(DIFFIO_TX_R68p,_DIFFOUT_R68p,_DQ9R,_DQ3R))
adc_d3_n: D4.D29(IO,_(DIFFIO_TX_R76n,_DIFFOUT_R76n,_DQ10R,_DQ3R))
adc_d3_p: D4.D28(IO,_(DIFFIO_TX_R76p,_DIFFOUT_R76p,_DQ10R,_DQ3R))
adc_d4_n: D4.D27(IO,_(DIFFIO_TX_R78n,_DIFFOUT_R78n,_DQ10R,_DQ3R))
adc_d4_p: D4.E27(IO,_(DIFFIO_TX_R78p,_DIFFOUT_R78p))
adc_d5_n: D4.E30(IO,_(DIFFIO_TX_R64n,_DIFFOUT_R64n))
adc_d5_p: D4.F30(IO,_(DIFFIO_TX_R64p,_DIFFOUT_R64p,_DQ8R,_DQ2R))
adc_d6_n: D4.F29(IO,_(DIFFIO_TX_R66n,_DIFFOUT_R66n,_DQ9R,_DQ3R))
adc_d6_p: D4.G29(IO,_(DIFFIO_TX_R66p,_DIFFOUT_R66p,_DQ9R,_DQ3R))
adc_d7_n: D4.G28(IO,_(DIFFIO_TX_R56n,_DIFFOUT_R56n))
adc_d7_p: D4.G27(IO,_(DIFFIO_TX_R56p,_DIFFOUT_R56p,_DQ7R,_DQ2R))
adc_d8_n: D4.H30(IO,_(DIFFIO_TX_R60n,_DIFFOUT_R60n,_DQ8R,_DQ2R))
adc_d8_p: D4.H29(IO,_(DIFFIO_TX_R60p,_DIFFOUT_R60p,_DQ8R,_DQ2R))
adc_d9_n: D4.J29(IO,_(DIFFIO_TX_R58n,_DIFFOUT_R58n,_DQ8R,_DQ2R))
adc_d9_p: D4.J28(IO,_(DIFFIO_TX_R58p,_DIFFOUT_R58p,_DQ8R,_DQ2R))
adc_d10_n: D4.J30(IO,_(DIFFIO_TX_R54n,_DIFFOUT_R54n,_DQ7R,_DQ2R))
adc_d10_p: D4.K30(IO,_(DIFFIO_TX_R54p,_DIFFOUT_R54p))
adc_d11_n: D4.L30(IO,_(DIFFIO_TX_R52n,_DIFFOUT_R52n,_DQ7R,_DQ2R))
adc_d11_p: D4.L29(IO,_(DIFFIO_TX_R52p,_DIFFOUT_R52p,_DQ7R,_DQ2R))
adc_d12_n: D4.N30(IO,_FPLL_TR_CLKOUT1,_FPLL_TR_CLKOUTn,_(DIFFIO_TX_R44n,_DIFFOUT_R44n,_DQ6R))
adc_d12_p: D4.M29(IO,_FPLL_TR_CLKOUT0,_FPLL_TR_CLKOUTp,_FPLL_TR_FB,_(DIFFIO_TX_R44p,_DIFFOUT_R44p,_DQ6R))
adc_d13_n: D4.N29(IO,_(DIFFIO_TX_R42n,_DIFFOUT_R42n,_DQ6R))
adc_d13_p: D4.P28(IO,_(DIFFIO_TX_R42p,_DIFFOUT_R42p,_DQ6R))
adc_dco_n: D4.E28(IO,_(DIFFIO_TX_R70n,_DIFFOUT_R70n,_DQ9R,_DQ3R))
adc_dco_p: D4.F28(IO,_(DIFFIO_TX_R70p,_DIFFOUT_R70p))
adc_sclk: D4.K28(IO,_(DIFFIO_TX_R46n,_DIFFOUT_R46n,_DQ6R))
adc_sdio: D4.L28(IO,_(DIFFIO_TX_R46p,_DIFFOUT_R46p))
adc_sync: D4.M27(IO,_(DIFFIO_TX_R48p,_DIFFOUT_R48p,_DQ6R))
cy_ctrl0: D4.W24(IO,_nPERSTL1,_(DIFFIO_RX_R6n,_DIFFOUT_R6n,_DQSn1R))
cy_ctrl1: D4.AC26(IO,_(DIFFIO_TX_R7p,_DIFFOUT_R7p,_DQ1R))
cy_ctrl2: D4.AC27(IO,_(DIFFIO_TX_R7n,_DIFFOUT_R7n))
cy_ctrl3: D4.Y22(IO,_(DIFFIO_RX_R8p,_DIFFOUT_R8p,_DQ1R))
cy_ctrl4: D4.AA23(IO,_(DIFFIO_RX_R8n,_DIFFOUT_R8n,_DQ1R))
cy_ctrl5: D4.AA24(IO,_(DIFFIO_RX_R9p,_DIFFOUT_R9p))
cy_ctrl6: D4.AA25(IO,_(DIFFIO_RX_R9n,_DIFFOUT_R9n))
cy_ctrl7: D4.AE23(IO,_(DIFFIO_TX_R10p,_DIFFOUT_R10p,_DQ2R))
cy_ctrl8: D4.AF24(IO,_(DIFFIO_TX_R10n,_DIFFOUT_R10n,_DQ2R))
cy_ctrl9: D4.AE27(IO,_(DIFFIO_RX_R11p,_DIFFOUT_R11p,_DQ2R))
cy_ctrl10: D4.AD27(IO,_(DIFFIO_RX_R11n,_DIFFOUT_R11n,_DQ2R))
cy_ctrl11: D4.AE25(IO,_(DIFFIO_TX_R12p,_DIFFOUT_R12p,_DQ2R))
cy_ctrl12: D4.AE26(IO,_(DIFFIO_TX_R12n,_DIFFOUT_R12n,_DQ2R))
cy_dq0: D4.U21(IO,_CLK7p,_FPLL_BR_FBp,_(DIFFIO_RX_R25p,_DIFFOUT_R25p))
cy_dq1: D4.U22(IO,_CLK7n,_FPLL_BR_FBn,_(DIFFIO_RX_R25n,_DIFFOUT_R25n))
cy_dq2: D4.AF29(IO,_(DIFFIO_TX_R26p,_DIFFOUT_R26p,_DQ4R,_DQ1R))
cy_dq3: D4.AF30(IO,_(DIFFIO_TX_R26n,_DIFFOUT_R26n,_DQ4R,_DQ1R))
cy_dq4: D4.V27(IO,_(DIFFIO_RX_R27p,_DIFFOUT_R27p,_DQ4R,_DQ1R))
cy_dq5: D4.W28(IO,_(DIFFIO_RX_R27n,_DIFFOUT_R27n,_DQ4R,_DQ1R))
cy_dq6: D4.AE28(IO,_(DIFFIO_TX_R28p,_DIFFOUT_R28p,_DQ4R,_DQ1R))
cy_dq7: D4.AD28(IO,_(DIFFIO_TX_R28n,_DIFFOUT_R28n,_DQ4R,_DQ1R))
cy_dq8: D4.U27(IO,_(DIFFIO_RX_R29p,_DIFFOUT_R29p,_DQS4R,_DQ1R))
cy_dq9: D4.U28(IO,_(DIFFIO_RX_R29n,_DIFFOUT_R29n,_DQSn4R,_DQ1R))
cy_dq10: D4.AD29(IO,_(DIFFIO_TX_R30p,_DIFFOUT_R30p))
cy_dq11: D4.AC29(IO,_(DIFFIO_TX_R30n,_DIFFOUT_R30n,_DQ4R,_DQ1R))
cy_dq12: D4.AA29(IO,_(DIFFIO_RX_R31p,_DIFFOUT_R31p,_DQ4R,_DQ1R))
cy_dq13: D4.AA30(IO,_(DIFFIO_RX_R31n,_DIFFOUT_R31n,_DQ4R,_DQ1R))
cy_dq14: D4.AB27(IO,_(DIFFIO_TX_R32p,_DIFFOUT_R32p,_DQ4R,_DQ1R))
cy_dq15: D4.AB28(IO,_(DIFFIO_TX_R32n,_DIFFOUT_R32n))
cy_dq16: D4.U23(IO,_CLK6p,_(DIFFIO_RX_R33p,_DIFFOUT_R33p))
cy_dq17: D4.T24(IO,_CLK6n,_(DIFFIO_RX_R33n,_DIFFOUT_R33n))
cy_dq18: D4.AB29(IO,_(DIFFIO_TX_R34p,_DIFFOUT_R34p,_DQ5R))
cy_dq19: D4.AC30(IO,_(DIFFIO_TX_R34n,_DIFFOUT_R34n,_DQ5R))
cy_dq20: D4.T28(IO,_(DIFFIO_RX_R35p,_DIFFOUT_R35p,_DQ5R))
cy_dq21: D4.T29(IO,_(DIFFIO_RX_R35n,_DIFFOUT_R35n,_DQ5R))
cy_dq22: D4.Y30(IO,_FPLL_BR_CLKOUT0,_FPLL_BR_CLKOUTp,_FPLL_BR_FB,_(DIFFIO_TX_R36p,_DIFFOUT_R36p,_DQ5R))
cy_dq23: D4.W30(IO,_FPLL_BR_CLKOUT1,_FPLL_BR_CLKOUTn,_(DIFFIO_TX_R36n,_DIFFOUT_R36n,_DQ5R))
cy_dq24: D4.T25(IO,_(DIFFIO_RX_R37p,_DIFFOUT_R37p,_DQS5R))
cy_dq25: D4.R26(IO,_(DIFFIO_RX_R37n,_DIFFOUT_R37n,_DQSn5R))
cy_dq26: D4.V29(IO,_(DIFFIO_TX_R38p,_DIFFOUT_R38p))
cy_dq27: D4.W29(IO,_(DIFFIO_TX_R38n,_DIFFOUT_R38n,_DQ5R))
cy_dq28: D4.T30(IO,_(DIFFIO_RX_R39p,_DIFFOUT_R39p,_DQ5R))
cy_dq29: D4.R30(IO,_(DIFFIO_RX_R39n,_DIFFOUT_R39n,_DQ5R))
cy_dq30: D4.U29(IO,_(DIFFIO_TX_R40p,_DIFFOUT_R40p,_DQ5R))
cy_dq31: D4.V30(IO,_(DIFFIO_TX_R40n,_DIFFOUT_R40n))
cy_pclk: D4.Y23(IO,_nPERSTL0,_(DIFFIO_RX_R6p,_DIFFOUT_R6p,_DQS1R))
ttl_clk: D4.AF25(IO,_(DIFFIO_TX_R14p,_DIFFOUT_R14p))
ttl_sdin: D4.AF26(IO,_(DIFFIO_TX_R14n,_DIFFOUT_R14n,_DQ2R))
ttl_sdout: D4.AH27(IO,_(DIFFIO_TX_R16p,_DIFFOUT_R16p,_DQ2R))
ttl_ss: D4.AG27(IO,_(DIFFIO_TX_R16n,_DIFFOUT_R16n))
NetD4_AD23: D4.AD23(IO,_RZQ_1,_(DIFFIO_TX_R1p,_DIFFOUT_R1p,_DQ1R)) R22.1

Not connected (* = marked no-connect by the designer): D4 AA26(IO,_DEV_CLRn,_(DIFFIO_TX_R5n,_DIFFOUT_R5n,_DQ1R)) AA28(IO,_(DIFFIO_RX_R19p,_DIFFOUT_R19p,_DQ3R,_DQ1R)) AB26(IO,_DEV_OE,_(DIFFIO_TX_R5p,_DIFFOUT_R5p)) AC24(IO,_PR_REQUEST,_(DIFFIO_TX_R1n,_DIFFOUT_R1n,_DQ1R)) AD24(IO,_nCEO,_(DIFFIO_TX_R3p,_DIFFOUT_R3p,_DQ1R)) AD25(IO,_CvP_CONFDONE,_(DIFFIO_TX_R3n,_DIFFOUT_R3n,_DQ1R)) AD30(IO,_(DIFFIO_RX_R23n,_DIFFOUT_R23n,_DQ3R,_DQ1R)) AE30(IO,_(DIFFIO_RX_R23p,_DIFFOUT_R23p,_DQ3R,_DQ1R)) AF28(IO,_(DIFFIO_TX_R24n,_DIFFOUT_R24n)) AG28(IO,_(DIFFIO_TX_R24p,_DIFFOUT_R24p,_DQ3R,_DQ1R)) AH30(IO,_(DIFFIO_TX_R22n,_DIFFOUT_R22n,_DQ3R,_DQ1R)) AJ30(IO,_(DIFFIO_TX_R22p,_DIFFOUT_R22p)) F25(IO,_(DIFFIO_RX_R63p,_DIFFOUT_R63p,_DQ8R,_DQ2R)) F26(IO,_(DIFFIO_RX_R63n,_DIFFOUT_R63n,_DQ8R,_DQ2R)) G26(IO,_(DIFFIO_TX_R62n,_DIFFOUT_R62n,_DQ8R,_DQ2R)) H24(IO,_(DIFFIO_TX_R80p,_DIFFOUT_R80p,_DQ10R,_DQ3R)) H25(IO,_(DIFFIO_RX_R75p,_DIFFOUT_R75p,_DQ10R,_DQ3R)) H26(IO,_(DIFFIO_RX_R75n,_DIFFOUT_R75n,_DQ10R,_DQ3R)) H27(IO,_(DIFFIO_TX_R62p,_DIFFOUT_R62p)) J22(IO,_(DIFFIO_RX_R79p,_DIFFOUT_R79p,_DQ10R,_DQ3R)) J23(IO,_(DIFFIO_RX_R79n,_DIFFOUT_R79n,_DQ10R,_DQ3R)) K21(IO,_(DIFFIO_RX_R71p,_DIFFOUT_R71p,_DQ9R,_DQ3R)) K22(IO,_(DIFFIO_RX_R71n,_DIFFOUT_R71n,_DQ9R,_DQ3R)) L21(IO,_(DIFFIO_RX_R73n,_DIFFOUT_R73n)) L23(IO,_(DIFFIO_RX_R67p,_DIFFOUT_R67p,_DQ9R,_DQ3R)) L24(IO,_(DIFFIO_RX_R67n,_DIFFOUT_R67n,_DQ9R,_DQ3R)) M21(IO,_(DIFFIO_RX_R73p,_DIFFOUT_R73p)) M22(IO,_(DIFFIO_RX_R69n,_DIFFOUT_R69n,_DQSn9R,_DQSn3R)) M23(IO,_(DIFFIO_RX_R61n,_DIFFOUT_R61n,_DQSn8R,_DQ2R)) N20(IO,_(DIFFIO_RX_R77n,_DIFFOUT_R77n,_DQSn10R,_DQ3R)) N21(IO,_(DIFFIO_RX_R69p,_DIFFOUT_R69p,_DQS9R,_DQS3R)) N22(IO,_(DIFFIO_RX_R61p,_DIFFOUT_R61p,_DQS8R,_DQ2R)) N24(IO,_(DIFFIO_RX_R53p,_DIFFOUT_R53p,_DQS7R,_DQS2R)) N25(IO,_(DIFFIO_RX_R53n,_DIFFOUT_R53n,_DQSn7R,_DQSn2R)) N26(IO,_(DIFFIO_RX_R51p,_DIFFOUT_R51p,_DQ7R,_DQ2R)) N27(IO,_(DIFFIO_RX_R51n,_DIFFOUT_R51n,_DQ7R,_DQ2R)) P20(IO,_(DIFFIO_RX_R77p,_DIFFOUT_R77p,_DQS10R,_DQ3R)) P25(IO,_(DIFFIO_RX_R45p,_DIFFOUT_R45p,_DQS6R)) P29(IO,_(DIFFIO_RX_R43p,_DIFFOUT_R43p,_DQ6R)) P30(IO,_(DIFFIO_RX_R43n,_DIFFOUT_R43n,_DQ6R)) R20(IO,_(DIFFIO_RX_R65p,_DIFFOUT_R65p)) R21(IO,_(DIFFIO_RX_R57p,_DIFFOUT_R57p)) R22(IO,_(DIFFIO_RX_R57n,_DIFFOUT_R57n)) R23(IO,_CLK5n,_(DIFFIO_RX_R41n,_DIFFOUT_R41n)) R25(IO,_(DIFFIO_RX_R45n,_DIFFOUT_R45n,_DQSn6R)) R27(IO,_(DIFFIO_RX_R47p,_DIFFOUT_R47p,_DQ6R)) R28(IO,_(DIFFIO_RX_R47n,_DIFFOUT_R47n,_DQ6R)) T21(IO,_(DIFFIO_RX_R65n,_DIFFOUT_R65n)) T23(IO,_CLK5p,_(DIFFIO_RX_R41p,_DIFFOUT_R41p)) U26(IO,_(DIFFIO_RX_R21n,_DIFFOUT_R21n,_DQSn3R,_DQSn1R)) V21(IO,_(DIFFIO_RX_R13p,_DIFFOUT_R13p,_DQS2R)) V22(IO,_(DIFFIO_RX_R13n,_DIFFOUT_R13n,_DQSn2R)) V24(IO,_(DIFFIO_RX_R17p,_DIFFOUT_R17p)) V25(IO,_(DIFFIO_RX_R17n,_DIFFOUT_R17n)) V26(IO,_(DIFFIO_RX_R21p,_DIFFOUT_R21p,_DQS3R,_DQS1R)) W22(IO,_INIT_DONE,_(DIFFIO_RX_R2p,_DIFFOUT_R2p)) W27(IO,_(DIFFIO_RX_R15n,_DIFFOUT_R15n,_DQ2R)) Y21(IO,_CRC_ERROR,_(DIFFIO_RX_R2n,_DIFFOUT_R2n)) Y25(IO,_(DIFFIO_RX_R4p,_DIFFOUT_R4p,_DQ1R)) Y26(IO,_(DIFFIO_RX_R4n,_DIFFOUT_R4n,_DQ1R)) Y27(IO,_(DIFFIO_RX_R15p,_DIFFOUT_R15p,_DQ2R)) Y28(IO,_(DIFFIO_RX_R19n,_DIFFOUT_R19n,_DQ3R,_DQ1R))

### Layout directives
differential pair: adc_d0_n, adc_d0_p, adc_d1_n, adc_d1_p, adc_d2_n, adc_d2_p, adc_d3_n, adc_d3_p, adc_d4_n, adc_d4_p, adc_d5_n, adc_d5_p, adc_d6_n, adc_d6_p, adc_d7_n, adc_d7_p, adc_d8_n, adc_d8_p, adc_d9_n, adc_d9_p, adc_d10_n, adc_d10_p, adc_d11_n, adc_d11_p, adc_d12_n, adc_d12_p, adc_d13_n, adc_d13_p, adc_dco_n, adc_dco_p

### Notes on the sheet
- Clock
- Title
- Size:
- Date:
- A3
- Number:
- Time:
- Revision:
- Sheet
- of
- File:
- (in symbol 5CEFA7F31C8N, part D) BANK 5A
- (in symbol 5CEFA7F31C8N, part E) BANK 5B
- (in symbol 5CEFA7F31C8N, part F) BANK 6A

### Library data of the parts
D4 = 5CEFA7F31C8N: as D4 on sheet as14120_x31_fpga_ddr; DatasheetVersion: Rev. 3.1; PackageReference: 896-FBGA-2000A; PackageDescription: 896-Pin FineLine Ball-Grid Array (FBGA), Body 31 x 31 mm, Pitch 1 mm; Supplier 1: Digi-Key; Supplier Part Number 1: 544-2768-ND; Supplier 2: Mouser; Supplier Part Number 2: 989-5CEFA7F31C8N; RoHS: RoHS Compliant; Subcategory: Cyclone V E; Voltage Supply: 1.07 to 1.13 V; Mounting Technology: Surface Mount; Code_JEDEC: MS-034-AAN-1; PartNumber: 5CEFA7F31C8N; ComponentLink1Description: Manufacturer URL; ComponentLink1URL: http://www.altera.com; ComponentLink2Description: Datasheet; ComponentLink2URL: http://www.altera.com/literature/hb/cyclone-v/cv_51002.pdf; ComponentLink3Description: Package Specification; ComponentLink3URL: http://www.altera.com/devicepackaging/04R00435-01.pdf; ComponentLink4Description: Device Handbook URL; ComponentLink4URL: http://www.altera.com/literature/hb/cyclone-v/cyclone5_handbook.pdf; ComponentLink5Description: Device Overview URL; ComponentLink5URL: http://www.altera.com/literature/hb/cyclone-v/cv_51001.pdf; ComponentLink6Description: Device Pin-Out URL; ComponentLink6URL: http://www.altera.com/literature/dp/cyclone-v/1.1.txt; ComponentLink7Description: Product URL; ComponentLink7URL: http://www.buyaltera.com/scripts/partsearch.dll?Detail&name=5CEFA7F31C8N-ND
R22 = RES_0603: 1K 0.1W 5% 0603 (1608 Metric)  SMD; Case-EIA: 0603; Case-Metric: 1608; Technology: SMT; Value: 240; Tolerance: 5 %; Power: 0.1 W

## Sheet as14120_x31_adc.SchDoc
size A3; PageSetup: Record=PageOptions|CenterHorizontal=True|CenterVertical=True|PrintScale=1.11|XCorrection=1.00|YCorrection=1.00|PrintKind=0|BorderSize=5000000|LeftOffset=0|BottomOffset=0|Orientation=2|PaperLength=1000|PaperWidth=1000|Scale=100|PaperSource=7|PrintQuality=-4|MediaType=1|DitherType=10|PaperKind=A4 (210 x 297 мм)|PrintScaleMode=1
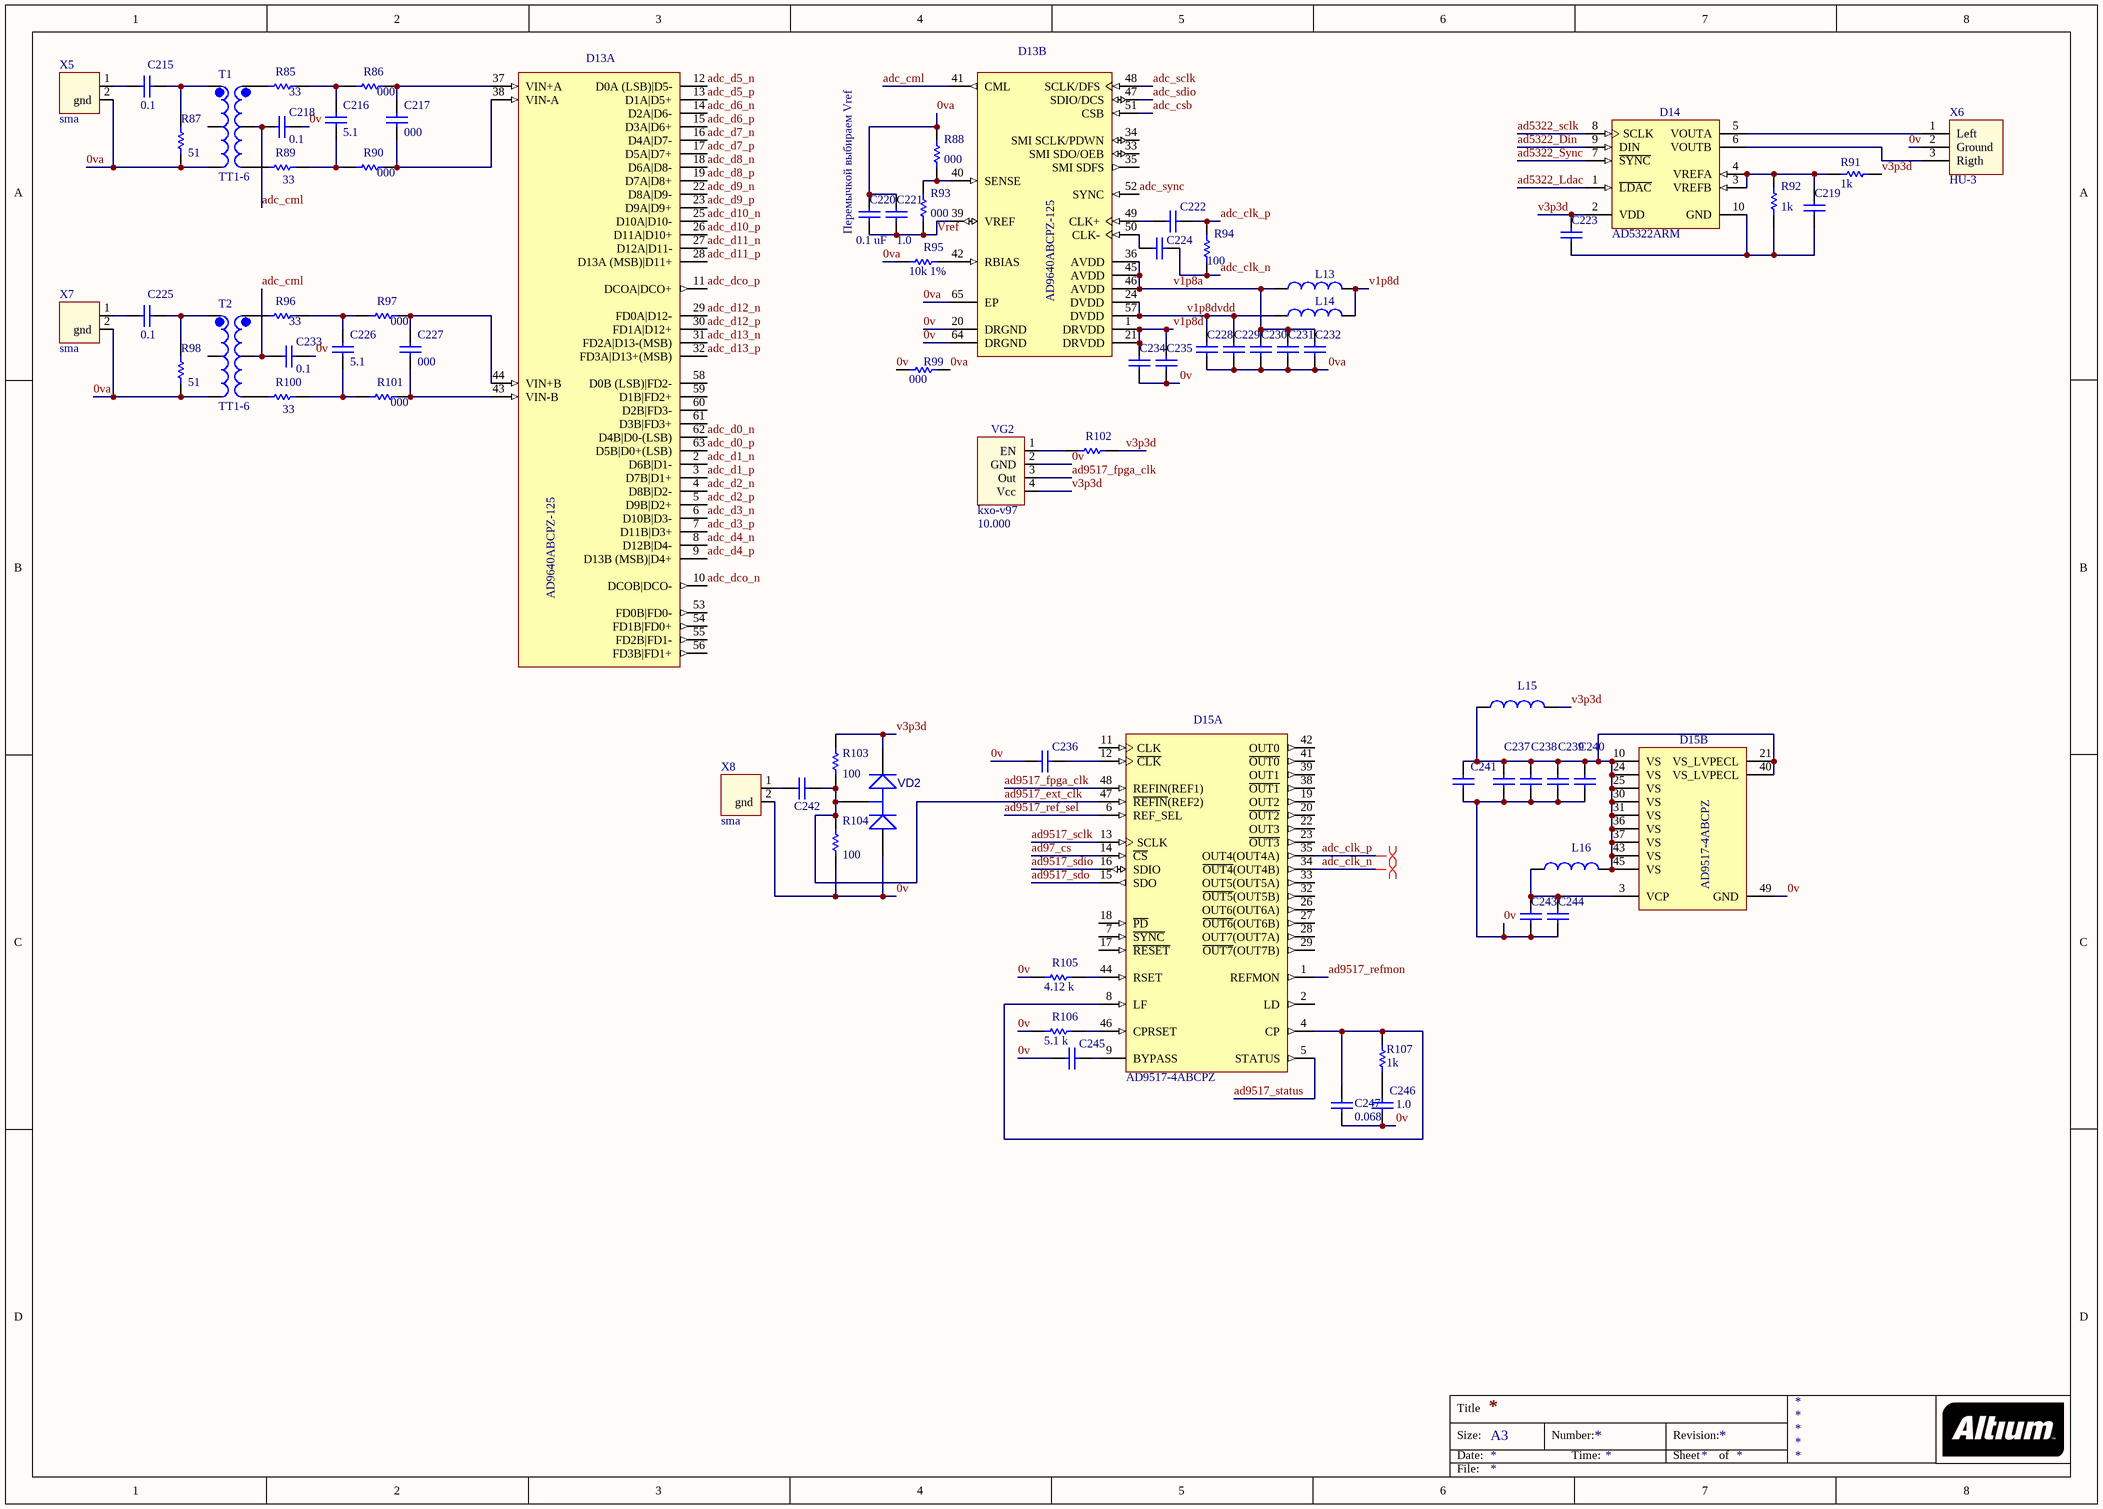
[diagram p7: as14120_x31_adc.SchDoc]

### Parts
C215  value 0.1  [CAPC0402(1005)60_M]  (hidden comment: CAP 1uF 10V 0402(1005))
C216  value 5.1  [CAPC0805(2012)100_N]  (hidden comment: CAP_0805)
C217  value 000  [CAPC0805(2012)100_N]  (hidden comment: CAP_0805)
C218  value 0.1  [CAPC0402(1005)60_M]  (hidden comment: CAP 1uF 10V 0402(1005))
C219  CAP 1uF 10V 0402(1005)  [CAPC0402(1005)60_M]  (value not drawn)
C220  value 0.1 uF  [CAPC0402(1005)60_M]  (hidden comment: CAP 1uF 10V 0402(1005))
C221  value 1.0  [CAPC0402(1005)60_M]  (hidden comment: CAP 1uF 10V 0402(1005))
C222  CAP 1uF 10V 0402(1005)  [CAPC0402(1005)60_M]  (value not drawn)
C223  CAP 1uF 10V 0402(1005)  [CAPC0402(1005)60_M]  (value not drawn)
C224  CAP 1uF 10V 0402(1005)  [CAPC0402(1005)60_M]  (value not drawn)
C225  value 0.1  [CAPC0402(1005)60_M]  (hidden comment: CAP 1uF 10V 0402(1005))
C226  value 5.1  [CAPC0805(2012)100_N]  (hidden comment: CAP_0805)
C227  value 000  [CAPC0805(2012)100_N]  (hidden comment: CAP_0805)
C228  CAP 1uF 10V 0402(1005)  [CAPC0402(1005)60_M]  (value not drawn)
C229  CAP 1uF 10V 0402(1005)  [CAPC0402(1005)60_M]  (value not drawn)
C230  CAP 1uF 10V 0402(1005)  [CAPC0402(1005)60_M]  (value not drawn)
C231  CAP 1uF 10V 0402(1005)  [CAPC0402(1005)60_M]  (value not drawn)
C232  CAP 1uF 10V 0402(1005)  [CAPC0402(1005)60_M]  (value not drawn)
C233  value 0.1  [CAPC0402(1005)60_M]  (hidden comment: CAP 1uF 10V 0402(1005))
C234  CAP 1uF 10V 0402(1005)  [CAPC0402(1005)60_M]  (value not drawn)
C235  CAP 1uF 10V 0402(1005)  [CAPC0402(1005)60_M]  (value not drawn)
C236  CAP 1uF 10V 0402(1005)  [CAPC0402(1005)60_M]  (value not drawn)
C237  CAP 1uF 10V 0402(1005)  [CAPC0402(1005)60_M]  (value not drawn)
C238  CAP 1uF 10V 0402(1005)  [CAPC0402(1005)60_M]  (value not drawn)
C239  CAP 1uF 10V 0402(1005)  [CAPC0402(1005)60_M]  (value not drawn)
C240  CAP 1uF 10V 0402(1005)  [CAPC0402(1005)60_M]  (value not drawn)
C241  CAP 1uF 10V 0402(1005)  [CAPC0402(1005)60_M]  (value not drawn)
C242  CAP 1uF 10V 0402(1005)  [CAPC0402(1005)60_M]  (value not drawn)
C243  CAP 1uF 10V 0402(1005)  [CAPC0402(1005)60_M]  (value not drawn)
C244  CAP 1uF 10V 0402(1005)  [CAPC0402(1005)60_M]  (value not drawn)
C245  CAP 1uF 10V 0402(1005)  [CAPC0402(1005)60_M]  (value not drawn)
C246  value 1.0  [CAPC0805(2012)100_N]  (hidden comment: CAP_0805)
C247  value 0.068  [CAPC0805(2012)100_N]  (hidden comment: CAP_0805)
D13  AD9640ABCPZ-125  [CP-64-6_N]  (parts A,B of 2)
D14  AD5322ARM  [RM-10_L]
D15  AD9517-4ABCPZ  [ADI-CP-48-8_L]  (parts A,B of 2)
L13  BLM21PG300SN1D  [CAPC0805(2012)100_N]  (value not drawn)
L14  BLM21PG300SN1D  [CAPC0805(2012)100_N]  (value not drawn)
L15  BLM21PG300SN1D  [CAPC0805(2012)100_N]  (value not drawn)
L16  BLM21PG300SN1D  [CAPC0805(2012)100_N]  (value not drawn)
R85  value 33  [RESC0805(2012)_L]  (hidden comment: 1K 1% 0805(2012))
R86  value 000  [RESC0805(2012)_L]  (hidden comment: 1K 1% 0805(2012))
R87  value 51  [RESC0805(2012)_L]  (hidden comment: 1K 1% 0805(2012))
R88  value 000  [RESC0603(1608)_L]  (hidden comment: 1K 5% 0603(1608))
R89  value 33  [RESC0805(2012)_L]  (hidden comment: 1K 1% 0805(2012))
R90  value 000  [RESC0805(2012)_L]  (hidden comment: 1K 1% 0805(2012))
R91  1k  [RESC0603(1608)_L]
R92  1k  [RESC0603(1608)_L]
R93  value 000  [RESC0603(1608)_L]  (hidden comment: 1K 5% 0603(1608))
R94  100  [RESC0805(2012)_L]
R95  10k 1%  [RESC0805(2012)_L]
R96  value 33  [RESC0805(2012)_L]  (hidden comment: 1K 1% 0805(2012))
R97  value 000  [RESC0805(2012)_L]  (hidden comment: 1K 1% 0805(2012))
R98  value 51  [RESC0805(2012)_L]  (hidden comment: 1K 1% 0805(2012))
R99  000  [RESC0603(1608)_L]
R100  value 33  [RESC0805(2012)_L]  (hidden comment: 1K 1% 0805(2012))
R101  value 000  [RESC0805(2012)_L]  (hidden comment: 1K 1% 0805(2012))
R102  1K 5% 0603(1608)  [RESC0603(1608)_L]  (value not drawn)
R103  value 100  [RESC0805(2012)_L]  (hidden comment: 1K 1% 0805(2012))
R104  value 100  [RESC0805(2012)_L]  (hidden comment: 1K 1% 0805(2012))
R105  value 4.12 k  [RESC0805(2012)_L]  (hidden comment: 1K 1% 0805(2012))
R106  value 5.1 k  [RESC0805(2012)_L]  (hidden comment: 1K 1% 0805(2012))
R107  value 1k  [RESC0805(2012)_L]  (hidden comment: 1K 1% 0805(2012))
T1  TT1-6  [TT!-6-KK81]
T2  TT1-6  [TT!-6-KK81]
VD2  BAV99  [SO-G3/X.9]  (value not drawn)
VG2  kxo-v97  value 10.000  [kxo-v97]
X5  sma  [sma]
X6  HU-3  [HU-3]
X7  sma  [sma]
X8  sma  [sma]

### Nets
0v: C218.2 C233.2 C234.1 C235.1 C236.1 C237.1 C238.1 C239.1 C240.1 C241.1 C243.1 C244.1 C245.1 C246.1 C247.1 D13.20(DRGND) D13.64(DRGND) D15.49(GND) R99.1 R104.1 R105.2 R106.2 VD2.3(A) VG2.2(GND) X6.2(Ground) X8.2(gnd)
0va: C220.2 C221.2 C228.1 C229.1 C230.1 C231.1 C232.1 D13.65(EP) R87.1 R88.1 R95.2 R98.1 R99.2 T1.6 T2.6 X5.2(gnd) X7.2(gnd)
ad97_cs: D15.14(~{CS})
ad5322_Din: D14.9(DIN)
ad5322_Ldac: D14.1(~{LDAC})
ad5322_sclk: D14.8(SCLK)
ad5322_Sync: D14.7(~{SYNC})
ad9517_ext_clk: C242.2 D15.47(~{REFIN}(REF2)) R103.1 R104.2 VD2.1(C)
ad9517_fpga_clk: D15.48(REFIN(REF1)) VG2.3(Out)
ad9517_ref_sel: D15.6(REF_SEL)
ad9517_refmon: D15.1(REFMON)
ad9517_sclk: D15.13(SCLK)
ad9517_sdio: D15.16(SDIO)
ad9517_sdo: D15.15(SDO)
ad9517_status: D15.5(STATUS)
adc_clk_n: C224.1 D15.34(~{OUT4}(OUT4B)) R94.1
adc_clk_p: C222.1 D15.35(OUT4(OUT4A)) R94.2
adc_cml: C218.1 C233.1 D13.41(CML) T1.2 T2.2
adc_csb: D13.51(CSB)
adc_d0_n: D13.62(D4B|D0-(LSB))
adc_d0_p: D13.63(D5B|D0+(LSB))
adc_d1_n: D13.2(D6B|D1-)
adc_d1_p: D13.3(D7B|D1+)
adc_d2_n: D13.4(D8B|D2-)
adc_d2_p: D13.5(D9B|D2+)
adc_d3_n: D13.6(D10B|D3-)
adc_d3_p: D13.7(D11B|D3+)
adc_d4_n: D13.8(D12B|D4-)
adc_d4_p: D13.9(D13B_(MSB)|D4+)
adc_d5_n: D13.12(D0A_(LSB)|D5-)
adc_d5_p: D13.13(D1A|D5+)
adc_d6_n: D13.14(D2A|D6-)
adc_d6_p: D13.15(D3A|D6+)
adc_d7_n: D13.16(D4A|D7-)
adc_d7_p: D13.17(D5A|D7+)
adc_d8_n: D13.18(D6A|D8-)
adc_d8_p: D13.19(D7A|D8+)
adc_d9_n: D13.22(D8A|D9-)
adc_d9_p: D13.23(D9A|D9+)
adc_d10_n: D13.25(D10A|D10-)
adc_d10_p: D13.26(D11A|D10+)
adc_d11_n: D13.27(D12A|D11-)
adc_d11_p: D13.28(D13A_(MSB)|D11+)
adc_d12_n: D13.29(FD0A|D12-)
adc_d12_p: D13.30(FD1A|D12+)
adc_d13_n: D13.31(FD2A|D13-(MSB))
adc_d13_p: D13.32(FD3A|D13+(MSB))
adc_dco_n: D13.10(DCOB|DCO-)
adc_dco_p: D13.11(DCOA|DCO+)
adc_sclk: D13.48(SCLK/DFS)
adc_sdio: D13.47(SDIO/DCS)
adc_sync: D13.52(SYNC)
v1p8a: C230.2 C231.2 C232.2 D13.36(AVDD) D13.45(AVDD) D13.46(AVDD) L13.1
v1p8d: C234.2 C235.2 D13.1(DRVDD) D13.21(DRVDD) L13.2 L14.2
v1p8dvdd: C228.2 C229.2 D13.24(DVDD) D13.57(DVDD) L14.1
v3p3d: C223.2 D14.2(VDD) L15.2 R91.2 R102.1 R103.2 VD2.2(K) VG2.4(Vcc)
Vref: C220.1 C221.1 D13.39(VREF) R93.2
NetC215_1: C215.1 X5.1
NetC215_2: C215.2 R87.2 T1.4
NetC216_1: C216.1 R89.1 R90.2
NetC216_2: C216.2 R85.1 R86.2
NetC217_1: C217.1 D13.38(VIN-A) R90.1
NetC217_2: C217.2 D13.37(VIN+A) R86.1
NetC219_1: C219.1 C223.1 D14.10(GND) R92.2
NetC219_2: C219.2 D14.3(VREFB) D14.4(VREFA) R91.1 R92.1
NetC222_2: C222.2 D13.49(CLK+)
NetC224_2: C224.2 D13.50(CLK-)
NetC225_1: C225.1 X7.1
NetC225_2: C225.2 R98.2 T2.4
NetC226_1: C226.1 R100.1 R101.2
NetC226_2: C226.2 R96.1 R97.2
NetC227_1: C227.1 D13.43(VIN-B) R101.1
NetC227_2: C227.2 D13.44(VIN+B) R97.1
NetC236_2: C236.2 D15.12(~{CLK})
NetC237_2: C237.2 C238.2 C239.2 C240.2 C241.2 D15.10(VS) D15.21(VS_LVPECL) D15.24(VS) D15.25(VS) D15.30(VS) D15.31(VS) D15.36(VS) D15.37(VS) D15.40(VS_LVPECL) D15.43(VS) D15.45(VS) L15.1 L16.2
NetC242_1: C242.1 X8.1
NetC243_2: C243.2 C244.2 D15.3(VCP) L16.1
NetC245_2: C245.2 D15.9(BYPASS)
NetC246_2: C246.2 R107.2
NetC247_2: C247.2 D15.4(CP) D15.8(LF) R107.1
NetD13_40: D13.40(SENSE) R88.2 R93.1
NetD13_42: D13.42(RBIAS) R95.1
NetD14_5: D14.5(VOUTA) X6.1(Left)
NetD14_6: D14.6(VOUTB) X6.3(Rigth)
NetD15_44: D15.44(RSET) R105.1
NetD15_46: D15.46(CPRSET) R106.1
NetR85_2: R85.2 T1.3
NetR89_2: R89.2 T1.1
NetR96_2: R96.2 T2.3
NetR100_2: R100.2 T2.1
NetR102_2: R102.2 VG2.1(EN)

Not connected (* = marked no-connect by the designer): D13 33(SMI_SDO/OEB) 34(SMI_SCLK/PDWN) 35(SMI_SDFS) 53(FD0B|FD0-) 54(FD1B|FD0+) 55(FD2B|FD1-) 56(FD3B|FD1+) 58(D0B_(LSB)|FD2-) 59(D1B|FD2+) 60(D2B|FD3-) 61(D3B|FD3+); D15 2(LD) 7(~{SYNC}) 11(CLK) 17(~{RESET}) 18(~{PD}) 19(OUT2) 20(~{OUT2}) 22(OUT3) 23(~{OUT3}) 26(OUT6(OUT6A)) 27(~{OUT6}(OUT6B)) 28(OUT7(OUT7A)) 29(~{OUT7}(OUT7B)) 32(~{OUT5}(OUT5B)) 33(OUT5(OUT5A)) 38(~{OUT1}) 39(OUT1) 41(~{OUT0}) 42(OUT0); T1 5; T2 5

### Layout directives
differential pair: adc_clk_n, adc_clk_p

### Notes on the sheet
- (near C220) Перемычкой выбираем Vref
- Title
- Size:
- Date:
- A3
- Number:
- Time:
- Revision:
- Sheet
- of
- File:

### Library data of the parts
C215 C218 C220 C221 C225 C233 = CAP_0402: CAP 1uF 10V ±20% 0402 (1005 Metric) Thickness 0.6mm SMD; Case-Metric: 1005; Case-EIA: 0402; Tolerance: ±20%; Max Thickness: 0.6 mm; Rated Voltage: 10 V; Technology: SMT
C219 C222-C224 C228-C232 C234-C241 C243-C245 = CAP_0402: CAP 1uF 10V ±20% 0402 (1005 Metric) Thickness 0.6mm SMD; Case-Metric: 1005; Case-EIA: 0402; Value: 0.1 uF; Tolerance: ±20%; Max Thickness: 0.6 mm; Rated Voltage: 10 V; Technology: SMT
C242 = CAP_0402: CAP 1uF 10V ±20% 0402 (1005 Metric) Thickness 0.6mm SMD; Case-Metric: 1005; Case-EIA: 0402; Value: 0.01 uF; Tolerance: ±20%; Max Thickness: 0.6 mm; Rated Voltage: 10 V; Technology: SMT
D13 = AD9640ABCPZ-125: Dual 14-Bit Analog-to-Digital Converter with Parallel Interface, 1.8 V, 125MSPS, -40 to +85 degC, CP-64-6, Pb-Free, Tray; Part Number: AD9640-125; Manufacturer: Analog Devices; Resolution (Bits): 14; Channels: 2; Throughput Rate (SPS): 125M; Interface: Par; DatasheetVersion: Rev.B; PackageVersion: 041509-A; PackageReference: CP-64-6; PackageDescription: 64-Lead Lead Frame Chip Scale Package [LFCSP_VQ] 9 x 9 mm Body, Very Thin Quad; RoHS: Y; Packing: Tray; Mounting Technology: Surface Mount; Code_JEDEC: MO-220-VMMD-4; ComponentLink1Description: Manufacturer URL; ComponentLink1URL: http://www.analog.com/en/index.html; ComponentLink2Description: Datasheet; ComponentLink2URL: http://www.analog.com/static/imported-files/data_sheets/AD9640.pdf; ComponentLink3Description: Package Specification; ComponentLink3URL: http://www.analog.com/static/imported-files/packages/PKG_PDF/LFCSP(CP)/CP_64_6.pdf; ComponentLink4Description: Product URL; ComponentLink4URL: http://www.analog.com/en/analog-to-digital-converters/ad-converters/ad9640/products/product.html
D14 = AD5322ARM: Dual 12-Bit Rail-to-Rail Output Digital-to-Analog Converter, 2.5 to 5.5 V, -40 to +105 degC, RM-10, Tube; ADI Part Number: AD5322; Manufacturer: Analog Devices; # DAC Outputs: 2; Max V+: 5.5V; Op Pwr Diss: 2.5mW; Resolution (Bits): 12; Settling Time: 8µs; Single Supply: Yes; DatasheetVersion: Rev.D; PackageVersion: May-2005; PackageReference: RM-10; PackageDescription: 10-Lead Mini Small Outline Package [MSOP]; Packing: Tube; RoHS: N; Mounting Technology: Surface Mount; ComponentLink1Description: Manufacturer URL; ComponentLink1URL: http://www.analog.com/en/index.html; ComponentLink2Description: Datasheet; ComponentLink2URL: http://www.analog.com/static/imported-files/data_sheets/AD5302_5312_5322.pdf; ComponentLink3Description: Package Specification; ComponentLink3URL: http://www.analog.com/static/imported-files/packages/PKG_PDF/MSOP%28RM%29/RM_10.pdf; ComponentLink4Description: URL Link1; ComponentLink4URL: Product URL:http://www.analog.com/en/digital-to-analog-converters/da-converters/ad5322/products/product.html
D15 = AD9517-4ABCPZ: 12-Output Clock Generator with Integrated 2.5 GHz VCO, 1800 MHz Max f-out, CP-48-8, Pb-Free, 260 Tray; Product Description: Multi-Output Clock Generator; +Supply Voltage (V): 3.3; Inputs: 2; Outputs: 12; Dividers: 4; On-Chip VCO or DCO: Yes; Max f-out (MHz): 1800; Output Logic: CMOS; LVDS; LVPECL; DatasheetVersion: Rev.D; PackageVersion: 02-23-2010-C; PackageReference: CP-48-8; PackageDescription: 48-Lead Lead Frame Chip Scale Package [LFCSP_VQ]; Code_JEDEC: MO-220-VKKD-2; ComponentLink1Description: Manufacturer URL; ComponentLink1URL: www.analog.com; ComponentLink2Description: Datasheet; ComponentLink2URL: http://www.analog.com/static/imported-files/data_sheets/AD9517-4.pdf; ComponentLink3Description: Package Specification; ComponentLink3URL: http://www.analog.com/static/imported-files/packages/PKG_PDF/LFCSP(CP)/CP_48_8.pdf
L13-L16 = Ferrite_beat
R85-R87 R89 R90 R94-R98 R100 R101 R103-R107 = RES_0805: as R23 on sheet as14120_x31_fpga_ddr; Tolerance: 1 %; Power: 0.125 W; Technology: SMT
  R94: Value: 100
  R95: Value: 10k 1%
R88 R91-R93 R99 = RES_0603: 1K 0.1W 5% 0603 (1608 Metric)  SMD; Case-Metric: 1608; Case-EIA: 0603; Tolerance: 5 %; Power: 0.1 W; Technology: SMT
  R91 R92: Value: 1k
  R99: Value: 000
R102 = RES_0603: 1K 0.1W 5% 0603 (1608 Metric)  SMD; Case-EIA: 0603; Case-Metric: 1608; Value: 1000.00 Ohm; Technology: SMT; Tolerance: 5 %; Power: 0.1 W
T1 T2 = TT1-6-KK81
VD2 = BAV99: SOT23 Silicon Planar High-Speed Switching Series Diode Pair; Value: {Value}; OriginalName: BAV99